# EAGLE design 150226_AriloRX_REV2_0_0 (EAGLE 6.4)
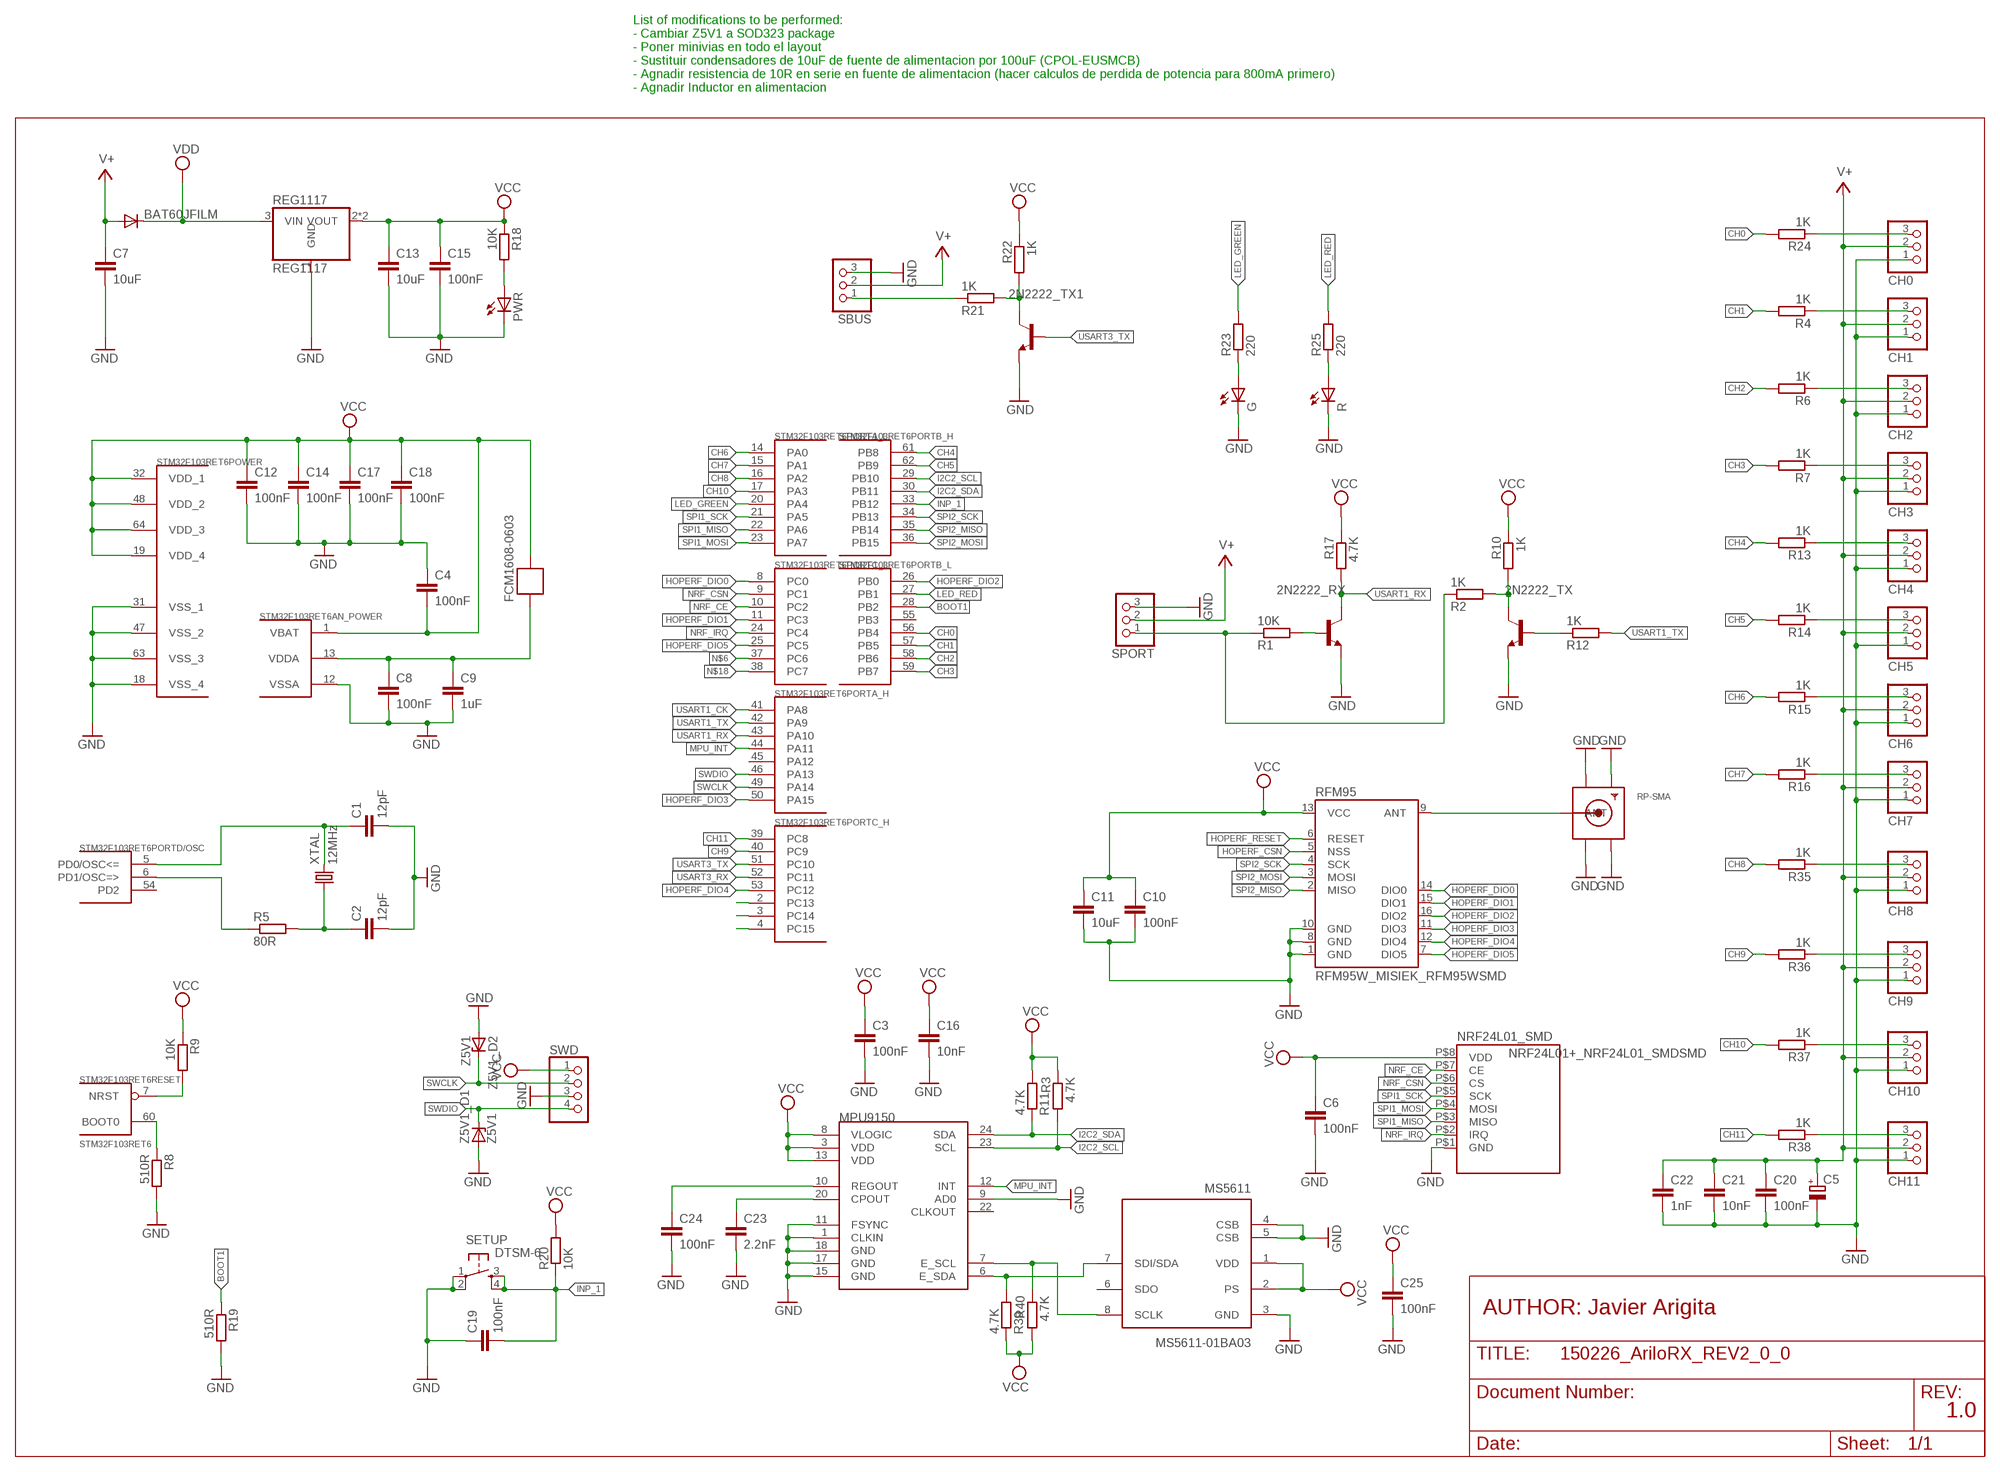
[diagram p0: schematic, sheet 1]

## Parts
2N2222_RX  MMBT2222ALT1-NPN-SOT23-BEC  [SOT23-BEC]
2N2222_TX  MMBT2222ALT1-NPN-SOT23-BEC  [SOT23-BEC]
2N2222_TX1  MMBT2222ALT1-NPN-SOT23-BEC  [SOT23-BEC]
BAT60JFILM  DIODE-SOD323-R  [SOD323-R]
C1  12pF  RESISTOR_C-EUC0603  [RESISTOR_C0603]
C2  12pF  RESISTOR_C-EUC0603  [RESISTOR_C0603]
C3  100nF  RESISTOR_C-EUC0603  [RESISTOR_C0603]
C4  100nF  RESISTOR_C-EUC0603  [RESISTOR_C0603]
C5  CPOL-EUSMCB  [SMC_B]
C6  100nF  RESISTOR_C-EUC0603  [RESISTOR_C0603]
C7  10uF  RESISTOR_C-EUC3216  [RESISTOR_C3216]
C8  100nF  RESISTOR_C-EUC0603  [RESISTOR_C0603]
C9  1uF  RESISTOR_C-EUC0603  [RESISTOR_C0603]
C10  100nF  RESISTOR_C-EUC0603  [RESISTOR_C0603]
C11  10uF  RESISTOR_C-EUC3216  [RESISTOR_C3216]
C12  100nF  RESISTOR_C-EUC0603  [RESISTOR_C0603]
C13  10uF  RESISTOR_C-EUC3216  [RESISTOR_C3216]
C14  100nF  RESISTOR_C-EUC0603  [RESISTOR_C0603]
C15  100nF  RESISTOR_C-EUC0603  [RESISTOR_C0603]
C16  10nF  RESISTOR_C-EUC0603  [RESISTOR_C0603]
C17  100nF  RESISTOR_C-EUC0603  [RESISTOR_C0603]
C18  100nF  RESISTOR_C-EUC0603  [RESISTOR_C0603]
C19  100nF  RESISTOR_C-EUC0603  [RESISTOR_C0603]
C20  100nF  RESISTOR_C-EUC0603  [RESISTOR_C0603]
C21  10nF  RESISTOR_C-EUC0603  [RESISTOR_C0603]
C22  1nF  RESISTOR_C-EUC0603  [RESISTOR_C0603]
C23  2.2nF  RESISTOR_C-EUC0603  [RESISTOR_C0603]
C24  100nF  RESISTOR_C-EUC0603  [RESISTOR_C0603]
C25  100nF  RESISTOR_C-EUC0603  [RESISTOR_C0603]
CH0  PINHD-1X3  [1X03]
CH1  PINHD-1X3  [1X03]
CH2  PINHD-1X3  [1X03]
CH3  PINHD-1X3  [1X03]
CH4  PINHD-1X3  [1X03]
CH5  PINHD-1X3  [1X03]
CH6  PINHD-1X3  [1X03]
CH7  PINHD-1X3  [1X03]
CH8  PINHD-1X3  [1X03]
CH9  PINHD-1X3  [1X03]
CH10  PINHD-1X3  [1X03]
CH11  PINHD-1X3  [1X03]
FCM1608-0603  FERRITE-BEAD  [R0603]
G  LEDCHIP-LED0603  [CHIP-LED0603]
MPU9150  MPU-9150QFN-24-NP  [QFN-24-NP]
MS5611  MS5611-01BA03  [SON125P300X500X100-8N]
NRF24L01_SMD  NRF24L01+_NRF24L01_SMDSMD  [NRF24L01+_NRF24L01_SMD]
PWR  LED_LEDCHIP-LED0603  [LED_CHIP-LED0603]
R  LEDCHIP-LED0603  [CHIP-LED0603]
R1  10K  RCL_R-EU_R0603  [RCL_R0603]
R2  1K  RCL_R-EU_R0603  [RCL_R0603]
R3  4.7K  RCL_R-EU_R0603  [RCL_R0603]
R4  1K  RCL_R-EU_R0603  [RCL_R0603]
R5  80R  RCL_R-EU_R0603  [RCL_R0603]
R6  1K  RCL_R-EU_R0603  [RCL_R0603]
R7  1K  RCL_R-EU_R0603  [RCL_R0603]
R8  510R  RCL_R-EU_R0603  [RCL_R0603]
R9  10K  RCL_R-EU_R0603  [RCL_R0603]
R10  1K  RCL_R-EU_R0603  [RCL_R0603]
R11  4.7K  RCL_R-EU_R0603  [RCL_R0603]
R12  1K  RCL_R-EU_R0603  [RCL_R0603]
R13  1K  RCL_R-EU_R0603  [RCL_R0603]
R14  1K  RCL_R-EU_R0603  [RCL_R0603]
R15  1K  RCL_R-EU_R0603  [RCL_R0603]
R16  1K  RCL_R-EU_R0603  [RCL_R0603]
R17  4.7K  RCL_R-EU_R0603  [RCL_R0603]
R18  10K  RCL_R-EU_R0603  [RCL_R0603]
R19  510R  RCL_R-EU_R0603  [RCL_R0603]
R20  10K  RCL_R-EU_R0603  [RCL_R0603]
R21  1K  RCL_R-EU_R0603  [RCL_R0603]
R22  1K  RCL_R-EU_R0603  [RCL_R0603]
R23  220  RCL_R-EU_R0603  [RCL_R0603]
R24  1K  RCL_R-EU_R0603  [RCL_R0603]
R25  220  RCL_R-EU_R0603  [RCL_R0603]
R35  1K  RCL_R-EU_R0603  [RCL_R0603]
R36  1K  RCL_R-EU_R0603  [RCL_R0603]
R37  1K  RCL_R-EU_R0603  [RCL_R0603]
R38  1K  RCL_R-EU_R0603  [RCL_R0603]
R39  4.7K  RCL_R-EU_R0603  [RCL_R0603]
R40  4.7K  RCL_R-EU_R0603  [RCL_R0603]
REG1117  REG1117  [SOT223]
RFM95  RFM95W_MISIEK_RFM95WSMD  [RFM95W_MISIEK_RFM95W_SMD]
RP-SMA  SMACONNECTOR_EDGE  [SMA_EDGELAUNCH]
SBUS  PINHD-1X3  [1X03]
SETUP  DTSM-6  [DTSM-6]
SPORT  PINHD-1X3  [1X03]
STM32F103RET6  STM32F103RET6  STM32F10XRXT6  [TQFP64]
SWD  PINHD-1X4  [1X04]
XTAL  12MHz  CRYSTAL5X3  [CRYSTAL-SMD-5X3]
Z5V1_D1  Z5V1  ZENER-DIODESOD80C  [SOD80C]
Z5V1_D2  Z5V1  ZENER-DIODESOD80C  [SOD80C]

## Nets
BOOT1: R19.1 STM32F103RET6.28(PORTB_L:PB2)
CH0: R24.2 STM32F103RET6.56(PORTB_L:PB4)
CH1: R4.2 STM32F103RET6.57(PORTB_L:PB5)
CH2: R6.2 STM32F103RET6.58(PORTB_L:PB6)
CH3: R7.2 STM32F103RET6.59(PORTB_L:PB7)
CH4: R13.2 STM32F103RET6.61(PORTB_H:PB8)
CH5: R14.2 STM32F103RET6.62(PORTB_H:PB9)
CH6: R15.2 STM32F103RET6.14(PORTA_L:PA0)
CH7: R16.2 STM32F103RET6.15(PORTA_L:PA1)
CH8: R35.2 STM32F103RET6.16(PORTA_L:PA2)
CH9: R36.2 STM32F103RET6.40(PORTC_H:PC9)
CH10: R37.2 STM32F103RET6.17(PORTA_L:PA3)
CH11: R38.2 STM32F103RET6.39(PORTC_H:PC8)
GND: 2N2222_RX.E 2N2222_TX1.E 2N2222_TX.E C1.2 C2.2 C3.2 C4.1 C5.- C6.2 C7.2 C8.2 C9.2 C10.2 C11.2 C12.2 C13.2 C14.2 C15.2 C16.2 C17.2 C18.2 C19.1 C20.2 C21.2 C22.2 C23.2 C24.2 C25.2 CH0.1 CH1.1 CH2.1 CH3.1 CH4.1 CH5.1 CH6.1 CH7.1 CH8.1 CH9.1 CH10.1 CH11.1 G.C MPU9150.1(CLKIN) MPU9150.9(AD0) MPU9150.11(FSYNC) MPU9150.15(GND) MPU9150.17(GND) MPU9150.18(GND) MS5611.3(GND) MS5611.4(CSB) MS5611.5(CSB) NRF24L01_SMD.P$1(GND) PWR.C R8.2 R19.2 R.C REG1117.1(GND) RFM95.1(GND) RFM95.8(GND) RFM95.10(GND) RP-SMA.GND@1(GND4) RP-SMA.GND@2(GND3) RP-SMA.GND@3(GND2) RP-SMA.GND@4(GND1) SBUS.3 SETUP.1 SETUP.2 SPORT.3 STM32F103RET6.12(AN_POWER:VSSA) STM32F103RET6.18(POWER:VSS_4) STM32F103RET6.31(POWER:VSS_1) STM32F103RET6.47(POWER:VSS_2) STM32F103RET6.63(POWER:VSS_3) SWD.3 Z5V1_D1.A Z5V1_D2.A
HOPERF_CSN: RFM95.5(NSS)
HOPERF_DIO0: RFM95.14(DIO0) STM32F103RET6.8(PORTC_L:PC0)
HOPERF_DIO1: RFM95.15(DIO1) STM32F103RET6.11(PORTC_L:PC3)
HOPERF_DIO2: RFM95.16(DIO2) STM32F103RET6.26(PORTB_L:PB0)
HOPERF_DIO3: RFM95.11(DIO3) STM32F103RET6.50(PORTA_H:PA15)
HOPERF_DIO4: RFM95.12(DIO4) STM32F103RET6.53(PORTC_H:PC12)
HOPERF_DIO5: RFM95.7(DIO5) STM32F103RET6.25(PORTC_L:PC5)
HOPERF_RESET: RFM95.6(RESET)
I2C2_SCL: MPU9150.23(SCL) R3.2 STM32F103RET6.29(PORTB_H:PB10)
I2C2_SDA: MPU9150.24(SDA) R11.1 STM32F103RET6.30(PORTB_H:PB11)
INP_1: C19.2 R20.1 SETUP.3 SETUP.4 STM32F103RET6.33(PORTB_H:PB12)
LED_GREEN: R23.2 STM32F103RET6.20(PORTA_L:PA4)
LED_RED: R25.2 STM32F103RET6.27(PORTB_L:PB1)
MPU_INT: MPU9150.12(INT) STM32F103RET6.44(PORTA_H:PA11)
N$1: C1.1 STM32F103RET6.5(PORTD/OSC:PD0/OSC<=) XTAL.3
N$2: R5.1 STM32F103RET6.6(PORTD/OSC:PD1/OSC=>)
N$3: C2.1 R5.2 XTAL.1
N$4: R8.1 STM32F103RET6.60(RESET:BOOT0)
N$5: 2N2222_TX.C R2.2 R10.2
N$6: STM32F103RET6.37(PORTC_L:PC6)
N$7: RFM95.9(ANT) RP-SMA.P(ANT)
N$8: 2N2222_TX.B R12.1
N$9: CH0.3 R24.1
N$10: PWR.A R18.2
N$11: 2N2222_TX1.C R21.2 R22.2
N$12: G.A R23.1
N$13: CH8.3 R35.1
N$14: R1.1 R2.1 SPORT.1
N$15: R25.1 R.A
N$16: 2N2222_RX.B R1.2
N$17: C8.1 C9.1 FCM1608-0603.2 STM32F103RET6.13(AN_POWER:VDDA)
N$18: STM32F103RET6.38(PORTC_L:PC7)
N$20: STM32F103RET6.2(PORTC_H:PC13)
N$21: CH2.3 R6.1
N$22: STM32F103RET6.3(PORTC_H:PC14)
N$23: CH4.3 R13.1
N$24: STM32F103RET6.4(PORTC_H:PC15)
N$25: CH9.3 R36.1
N$26: CH10.3 R37.1
N$27: CH11.3 R38.1
N$28: MPU9150.7(E_SCL) MS5611.8(SCLK) R40.1
N$29: MPU9150.6(E_SDA) MS5611.7(SDI/SDA) R39.2
N$31: CH3.3 R7.1
N$32: CH6.3 R15.1
N$33: C23.1 MPU9150.20(CPOUT)
N$34: CH5.3 R14.1
N$35: CH7.3 R16.1
N$40: C24.1 MPU9150.10(REGOUT)
N$53: CH1.3 R4.1
NRF_CE: NRF24L01_SMD.P$7(CE) STM32F103RET6.10(PORTC_L:PC2)
NRF_CSN: NRF24L01_SMD.P$6(CS) STM32F103RET6.9(PORTC_L:PC1)
NRF_IRQ: NRF24L01_SMD.P$2(IRQ) STM32F103RET6.24(PORTC_L:PC4)
NSRST: R9.2 STM32F103RET6.7(RESET:NRST)
SBUS: R21.1 SBUS.1
SPI1_MISO: NRF24L01_SMD.P$3(MISO) STM32F103RET6.22(PORTA_L:PA6)
SPI1_MOSI: NRF24L01_SMD.P$4(MOSI) STM32F103RET6.23(PORTA_L:PA7)
SPI1_SCK: NRF24L01_SMD.P$5(SCK) STM32F103RET6.21(PORTA_L:PA5)
SPI2_MISO: RFM95.2(MISO) STM32F103RET6.35(PORTB_H:PB14)
SPI2_MOSI: RFM95.3(MOSI) STM32F103RET6.36(PORTB_H:PB15)
SPI2_SCK: RFM95.4(SCK) STM32F103RET6.34(PORTB_H:PB13)
SWCLK: STM32F103RET6.49(PORTA_H:PA14) SWD.2 Z5V1_D2.C
SWDIO: STM32F103RET6.46(PORTA_H:PA13) SWD.4 Z5V1_D1.C
USART1_CK: STM32F103RET6.41(PORTA_H:PA8)
USART1_RX: 2N2222_RX.C R17.2 STM32F103RET6.43(PORTA_H:PA10)
USART1_TX: R12.2 STM32F103RET6.42(PORTA_H:PA9)
USART3_RX: STM32F103RET6.52(PORTC_H:PC11)
USART3_TX: 2N2222_TX1.B STM32F103RET6.51(PORTC_H:PC10)
V+: BAT60JFILM.A C5.+ C7.1 C20.1 C21.1 C22.1 CH0.2 CH1.2 CH2.2 CH3.2 CH4.2 CH5.2 CH6.2 CH7.2 CH8.2 CH9.2 CH10.2 CH11.2 SBUS.2 SPORT.2
VCC: C3.1 C4.2 C6.1 C10.1 C11.1 C12.1 C13.1 C14.1 C15.1 C16.1 C17.1 C18.1 C25.1 FCM1608-0603.1 MPU9150.3(VDD) MPU9150.8(VLOGIC) MPU9150.13(VDD) MS5611.1(VDD) MS5611.2(PS) NRF24L01_SMD.P$8(VDD) R3.1 R9.1 R10.1 R11.2 R17.1 R18.1 R20.2 R22.1 R39.1 R40.2 REG1117.2(VOUT) REG1117.4(VOUT) RFM95.13(VCC) STM32F103RET6.1(AN_POWER:VBAT) STM32F103RET6.19(POWER:VDD_4) STM32F103RET6.32(POWER:VDD_1) STM32F103RET6.48(POWER:VDD_2) STM32F103RET6.64(POWER:VDD_3) SWD.1
VDD: BAT60JFILM.C REG1117.3(VIN)
Unconnected: MPU9150.22(CLKOUT) MS5611.6(SDO) STM32F103RET6.45(PORTA_H:PA12) STM32F103RET6.54(PORTD/OSC:PD2) STM32F103RET6.55(PORTB_L:PB3)

## Notes on the sheet
- List of modifications to be performed:
  - Cambiar Z5V1 a SOD323 package
  - Poner minivias en todo el layout
  - Sustituir condensadores de 10uF de fuente de alimentacion por 100uF (CPOL-EUSMCB)
  - Agnadir resistencia de 10R en serie en fuente de alimentacion (hacer calculos de perdida de potencia para 800mA primero)
  - Agnadir Inductor en alimentacion
- AUTHOR: Javier Arigita
- 1.0

## Library data of the parts
2N2222_RX 2N2222_TX 2N2222_TX1 = transistor:*-NPN-: NPN Transistror BF959 corrected 2008.03.06
BAT60JFILM = diode:DIODE-: DIODE
C1-C4 C6-C25 = AriloTX:RESISTOR_C-EU: CAPACITOR, European symbol
C5 = rcl:CPOL-EU: POLARIZED CAPACITOR, European symbol
CH0 CH1-CH11 SBUS SPORT = pinhead_rc:PINHD-1X3: PIN HEADER
FCM1608-0603 = BaseApp:FERRITE-BEAD
G R = led:LED: LED OSRAM: - CHIPLED LG R971, LG N971, LY N971, LG Q971, LY Q971, LO R971, LY R971 LH N974, LH R974 LS Q976, LO Q976, LY Q976 LO Q996 - Hyper CHIPLED LW Q18S LB Q993, LB Q99A, LB R99A - SideLED LS A670, LO A670, LY A670, LG A670, LP A670 LB A673, LV A673, LT A673, LW A673 LH A674 LY A675 LS A676, LA A676, LO A676, LY A676, LW A676 LS A679, LY A679, LG A679 - Hyper Micro SIDELED® LS Y876, LA Y876, LO Y876, LY Y876 LT Y87S - SmartLED LW L88C, LW L88S LB L89C, LB L89S, LG L890 LS L89K, LO L89K, LY L89K LS L896, LA L896, LO L896, LY L896 - TOPLED LS T670, LO T670, LY T670, LG T670, LP T670 LSG T670, LSP T670, LSY T670, LOP T670, LYG T670 LG T671, LOG T671, LSG T671 LB T673, LV T673, LT T673, LW T673 LH T674 LS T676, LA T676, LO T676, LY T676, LB T676, LH T676, LSB T676, LW T676 LB T67C, LV T67C, LT T67C, LS T67K, LO T67K, LY T67K, LW E67C LS E67B, LA E67B, LO E67B, LY E67B, LB E67C, LV E67C, LT E67C LW T67C LS T679, LY T679, LG T679 LS T770, LO T770, LY T770, LG T770, LP T770 LB T773, LV T773, LT T773, LW T773 LH T774 LS E675, LA E675, LY E675, LS T675 LS T776, LA T776, LO T776, LY T776, LB T776 LHGB T686 LT T68C, LB T68C - Hyper Mini TOPLED® LB M676 - Mini TOPLED Santana® LG M470 LS M47K, LO M47K, LY M47K Source: http://www.osram.convergy.de LUXEON: - LUMILED® LXK2-PW12-R00, LXK2-PW12-S00, LXK2-PW14-U00, LXK2-PW14-V00 LXK2-PM12-R00, LXK2-PM12-S00, LXK2-PM14-U00 LXK2-PE12-Q00, LXK2-PE12-R00, LXK2-PE12-S00, LXK2-PE14-T00, LXK2-PE14-U00 LXK2-PB12-K00, LXK2-PB12-L00, LXK2-PB12-M00, LXK2-PB14-N00, LXK2-PB14-P00, LXK2-PB14-Q00 LXK2-PR12-L00, LXK2-PR12-M00, LXK2-PR14-Q00, LXK2-PR14-R00 LXK2-PD12-Q00, LXK2-PD12-R00, LXK2-PD12-S00 LXK2-PH12-R00, LXK2-PH12-S00 LXK2-PL12-P00, LXK2-PL12-Q00, LXK2-PL12-R00 Source: www.luxeon.com KINGBRIGHT: KA-3528ASYC Source: www.kingbright.com
MPU9150 = SparkFun-Sensors:MPU-9150: 9DOF (3mag, 3accel, 3rotat). I2C interface.
MS5611 = Measurement-Specialties:MS5611-01BA03: Variometer Module, with stainless steel cap
NRF24L01_SMD = Arilo_TX140810_AriloTX_REV3_0_0_868MHZ_td:NRF24L01+_NRF24L01_SMD
PWR = AriloTX:LED_LED: LED OSRAM: - CHIPLED LG R971, LG N971, LY N971, LG Q971, LY Q971, LO R971, LY R971 LH N974, LH R974 LS Q976, LO Q976, LY Q976 LO Q996 - Hyper CHIPLED LW Q18S LB Q993, LB Q99A, LB R99A - SideLED LS A670, LO A670, LY A670, LG A670, LP A670 LB A673, LV A673, LT A673, LW A673 LH A674 LY A675 LS A676, LA A676, LO A676, LY A676, LW A676 LS A679, LY A679, LG A679 - Hyper Micro SIDELED® LS Y876, LA Y876, LO Y876, LY Y876 LT Y87S - SmartLED LW L88C, LW L88S LB L89C, LB L89S, LG L890 LS L89K, LO L89K, LY L89K LS L896, LA L896, LO L896, LY L896 - TOPLED LS T670, LO T670, LY T670, LG T670, LP T670 LSG T670, LSP T670, LSY T670, LOP T670, LYG T670 LG T671, LOG T671, LSG T671 LB T673, LV T673, LT T673, LW T673 LH T674 LS T676, LA T676, LO T676, LY T676, LB T676, LH T676, LSB T676, LW T676 LB T67C, LV T67C, LT T67C, LS T67K, LO T67K, LY T67K, LW E67C LS E67B, LA E67B, LO E67B, LY E67B, LB E67C, LV E67C, LT E67C LW T67C LS T679, LY T679, LG T679 LS T770, LO T770, LY T770, LG T770, LP T770 LB T773, LV T773, LT T773, LW T773 LH T774 LS E675, LA E675, LY E675, LS T675 LS T776, LA T776, LO T776, LY T776, LB T776 LHGB T686 LT T68C, LB T68C - Hyper Mini TOPLED® LB M676 - Mini TOPLED Santana® LG M470 LS M47K, LO M47K, LY M47K Source: http://www.osram.convergy.de LUXEON: - LUMILED® LXK2-PW12-R00, LXK2-PW12-S00, LXK2-PW14-U00, LXK2-PW14-V00 LXK2-PM12-R00, LXK2-PM12-S00, LXK2-PM14-U00 LXK2-PE12-Q00, LXK2-PE12-R00, LXK2-PE12-S00, LXK2-PE14-T00, LXK2-PE14-U00 LXK2-PB12-K00, LXK2-PB12-L00, LXK2-PB12-M00, LXK2-PB14-N00, LXK2-PB14-P00, LXK2-PB14-Q00 LXK2-PR12-L00, LXK2-PR12-M00, LXK2-PR14-Q00, LXK2-PR14-R00 LXK2-PD12-Q00, LXK2-PD12-R00, LXK2-PD12-S00 LXK2-PH12-R00, LXK2-PH12-S00 LXK2-PL12-P00, LXK2-PL12-Q00, LXK2-PL12-R00 Source: www.luxeon.com KINGBRIGHT: KA-3528ASYC Source: www.kingbright.com
R1-R25 R35-R40 = AriloTX:RCL_R-EU_: RESISTOR, European symbol
REG1117 = CEDT:REG1117: 800mA and 1A Low Dropout (LDO) Positive Regulator 1.8V, 2.5V, 2.85V, 3.3V, 5V, and Adj
RFM95 = AriloTX:RFM95W_MISIEK_RFM95W
RP-SMA = adafruit:SMACONNECTOR: SMA Connector 90° DIP SMA Connector, 50 Ohm (4UConnector: 07259)
SETUP = switch-tact:DTSM-6
STM32F103RET6 = stm32:STM32F10XRXT6: STM32F101/103 64pin LQFP
SWD = pinhead:PINHD-1X4: PIN HEADER
XTAL = SparkFun-FreqCtrl:CRYSTAL: Various standard crystals. Proven footprints. Spark Fun Electronics SKU : COM-00534
Z5V1_D1 Z5V1_D2 = diode:ZENER-DIODE: Z-Diode

## Board
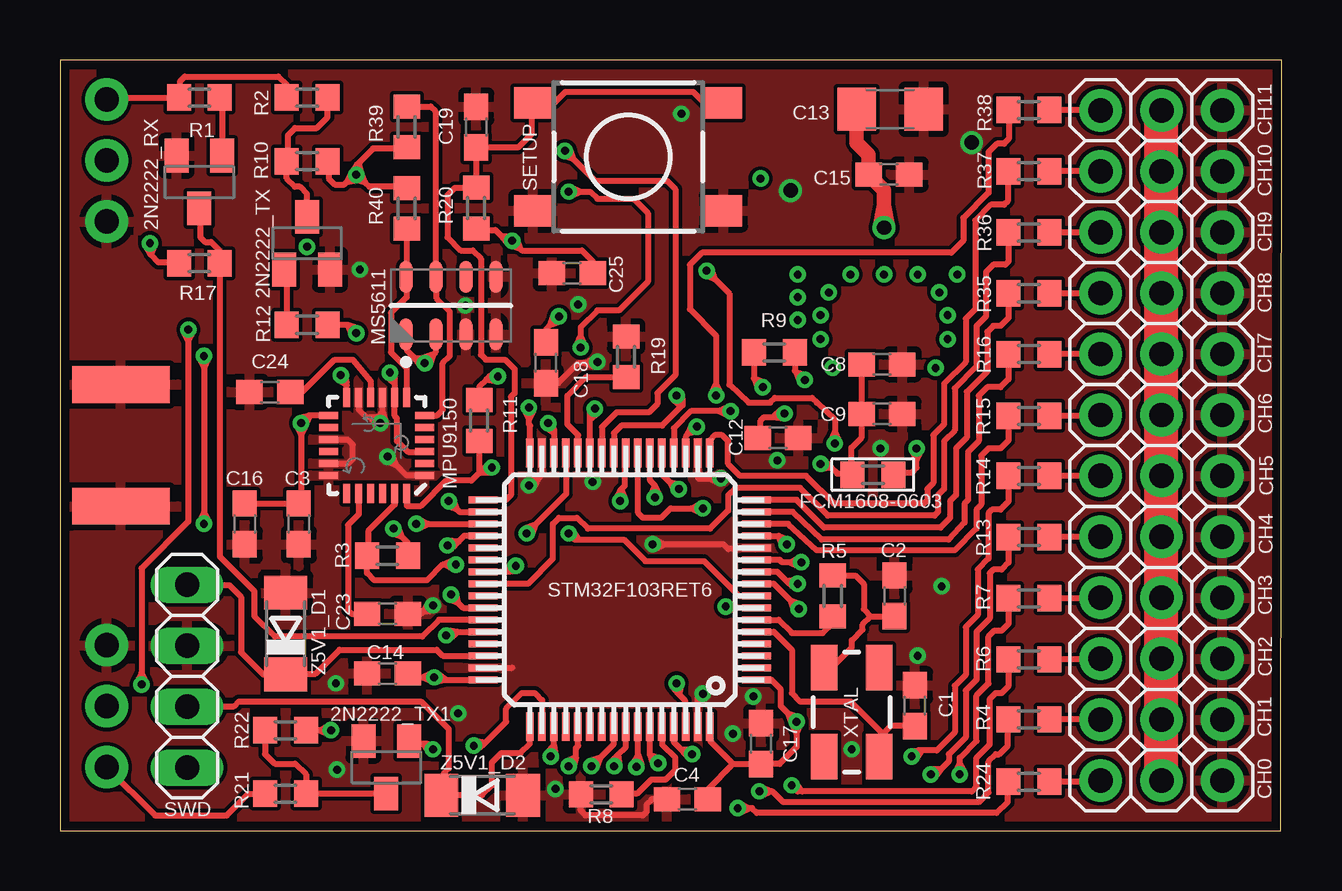
[diagram p1: board, top side]
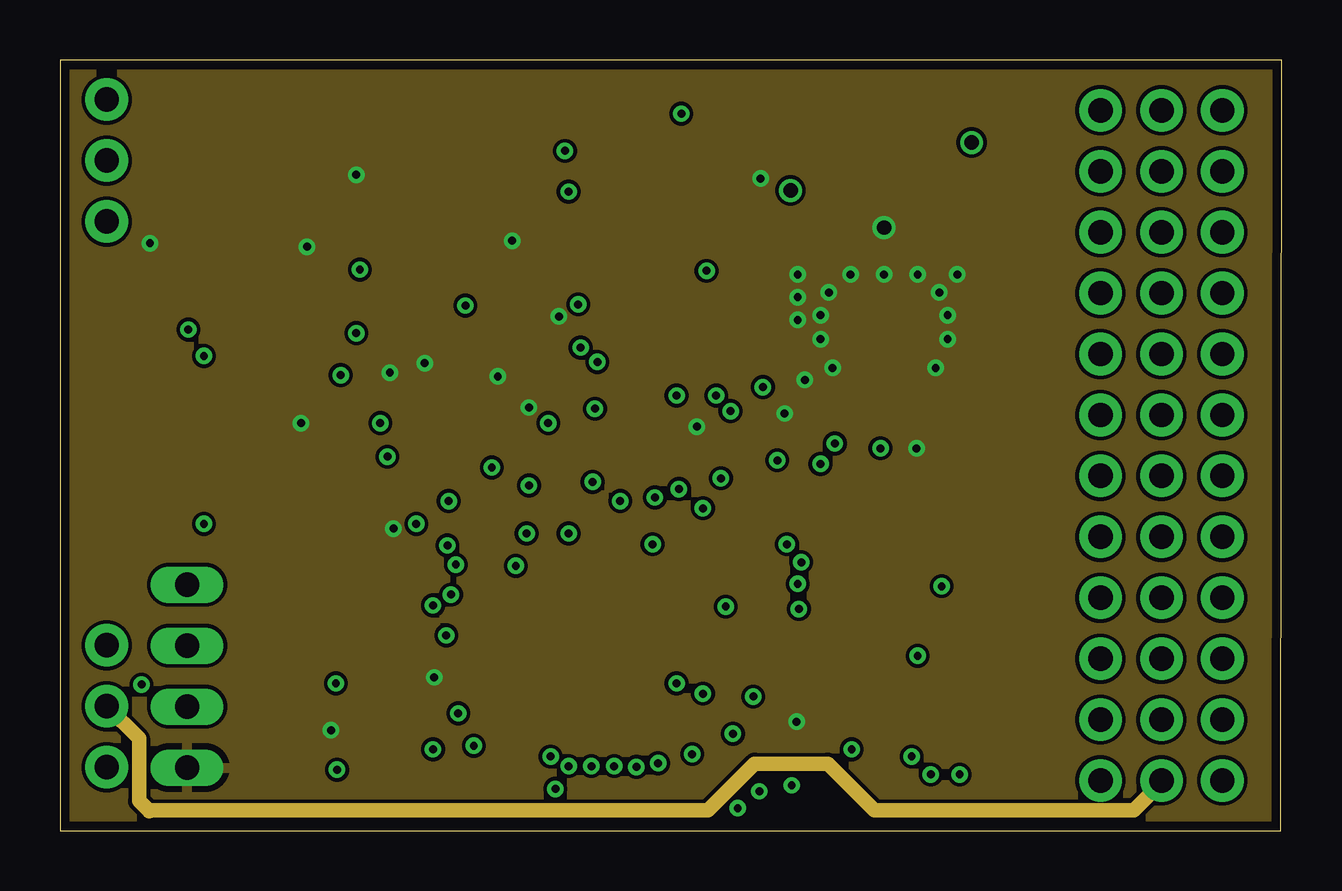
[diagram p2: board, inner layer Route2]
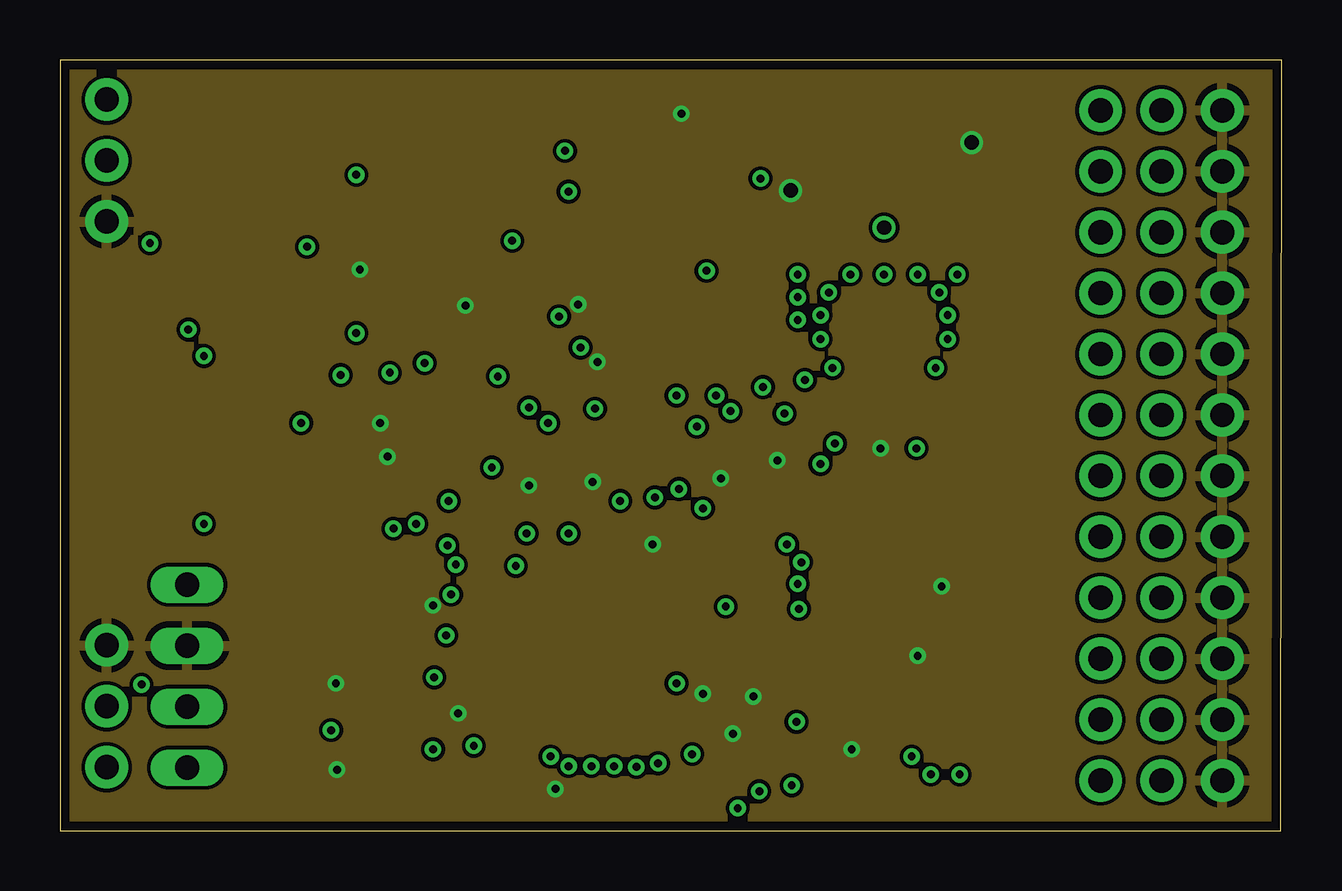
[diagram p3: board, inner layer Route15]
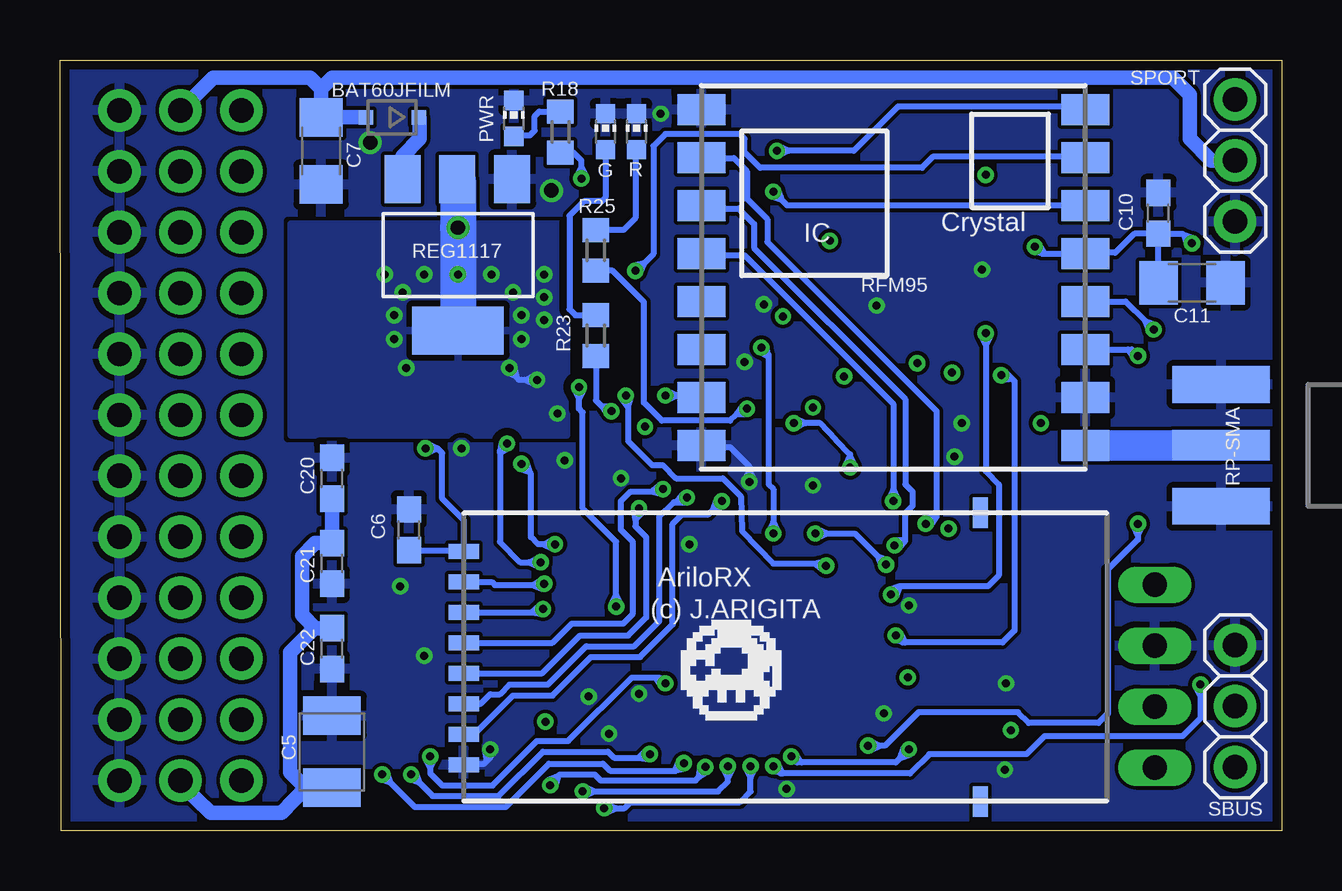
[diagram p4: board, bottom side, seen from below]

Size 50.94 x 32.14 mm. Coordinates in mm from the lower left corner, seen from the top.
Outline: 0,0 50.88,0 50.94,32.14 0,32.14 0,0
Copper layers (1*2*15*16): Top 0.0356mm / dielectric 0.17018125mm / Route2 0.0178mm / dielectric 47mil / Route15 0.0178mm / dielectric 0.17018125mm / Bottom 0.0356mm
Design rules "LaenPCBOrder *": minimum track width 6mil, minimum drill 13mil, track to track 6mil, track to pad 6mil, pad to pad 6mil, via to via 6mil, smd to smd 6mil, copper to edge 15mil, drill to drill 6mil, minimum pad ring 7mil, minimum via ring 7mil, stop-mask expansion 4mil, vias tented up to drill 0mil, thermal gap 10mil

### Footprints (pad centres in the part's own frame; a part is rotated, then mirrored left to right if it is on the bottom)
SOT23-BEC = smd 1 x 1.4: B -0.95,-1.1; C 0,1.1; E 0.95,-1.1
SOD323-R = smd 0.6 x 0.6: A 1.1,0; C -1.1,0
RESISTOR_C0603 = smd 1.1 x 1: 1 -0.85,0; 2 0.85,0
SMC_B = smd 1.6 x 2.4: + -1.5,0; - 1.5,0
RESISTOR_C3216 = smd 1.6 x 1.8: 1 -1.4,0; 2 1.4,0
1X03 = drill 1.016 pad 1.778: 1 -2.54,0; 2 0,0; 3 2.54,0
R0603 = smd 1 x 1.1: 1 -0.85,0; 2 0.85,0
CHIP-LED0603 = smd 0.8 x 0.8: A 0,-0.75; C 0,0.75
QFN-24-NP = smd 0.8 x 0.3: 1 -2,1.25; 2 -2,0.75; 3 -2,0.25; 4 -2,-0.25; 5 -2,-0.75; 6 -2,-1.25; 13 2,-1.25; 14 2,-0.75; 15 2,-0.25; 16 2,0.25; 17 2,0.75; 18 2,1.25 | smd 0.3 x 0.8: 7 -1.25,-2; 8 -0.75,-2; 9 -0.25,-2; 10 0.25,-2; 11 0.75,-2; 12 1.25,-2; 19 1.25,2; 20 0.75,2; 21 0.25,2; 22 -0.25,2; 23 -0.75,2; 24 -1.25,2
SON125P300X500X100-8N = smd 1.35 x 0.55: 1 -1.2,1.875; 2 -1.2,0.625; 3 -1.2,-0.625; 4 -1.2,-1.875; 5 1.2,-1.875; 6 1.2,-0.625; 7 1.2,0.625; 8 1.2,1.875
NRF24L01+_NRF24L01_SMD = smd 1.27 x 0.635: P$1 26.807,10.492; P$2 26.807,9.222; P$3 26.807,7.952; P$4 26.807,6.682; P$5 26.807,5.412; P$6 26.807,4.142; P$7 26.807,2.872; P$8 26.807,1.602 | smd 0.635 x 1.27: P$11 5.267,-0.018; P$13 5.267,12.032
LED_CHIP-LED0603 = smd 0.8 x 0.8: A 0,-0.75; C 0,0.75
RCL_R0603 = smd 1 x 1.1: 1 -0.85,0; 2 0.85,0
SOT223 = smd 1.499 x 2.007: 1 -2.261,-3.15; 2 0.025,-3.15; 3 2.311,-3.15 | smd 3.81 x 2.007: 4 0,3.15
RFM95W_MISIEK_RFM95W_SMD = smd 2 x 1.3: 1 -8,7; 2 -8,5; 3 -8,3; 4 -8,1; 5 -8,-1; 6 -8,-3; 7 -8,-5; 8 -8,-7; 9 8,-7; 10 8,-5; 11 8,-3; 12 8,-1; 13 8,1; 14 8,3; 15 8,5; 16 8,7
SMA_EDGELAUNCH = smd 4.064 x 1.524: GND@1 2.032,-2.54; GND@2 2.032,2.54 | smd 4.064 x 1.524 bottom: GND@3 2.032,2.54; GND@4 2.032,-2.54 | smd 4.064 x 1.27: P 2.032,0
DTSM-6 = smd 1.55 x 1.3: 1 -3.975,2.25; 2 3.975,2.25; 3 -3.975,-2.25; 4 3.975,-2.25
TQFP64 = smd 1.2 x 0.3: 1 -5.7,3.75; 2 -5.7,3.25; 3 -5.7,2.75; 4 -5.7,2.25; 5 -5.7,1.75; 6 -5.7,1.25; 7 -5.7,0.75; 8 -5.7,0.25; 9 -5.7,-0.25; 10 -5.7,-0.75; 11 -5.7,-1.25; 12 -5.7,-1.75; 13 -5.7,-2.25; 14 -5.7,-2.75; 15 -5.7,-3.25; 16 -5.7,-3.75; 33 5.7,-3.75; 34 5.7,-3.25; 35 5.7,-2.75; 36 5.7,-2.25; 37 5.7,-1.75; 38 5.7,-1.25; 39 5.7,-0.75; 40 5.7,-0.25; 41 5.7,0.25; 42 5.7,0.75; 43 5.7,1.25; 44 5.7,1.75; 45 5.7,2.25; 46 5.7,2.75; 47 5.7,3.25; 48 5.7,3.75 | smd 0.3 x 1.2: 17 -3.75,-5.7; 18 -3.25,-5.7; 19 -2.75,-5.7; 20 -2.25,-5.7; 21 -1.75,-5.7; 22 -1.25,-5.7; 23 -0.75,-5.7; 24 -0.25,-5.7; 25 0.25,-5.7; 26 0.75,-5.7; 27 1.25,-5.7; 28 1.75,-5.7; 29 2.25,-5.7; 30 2.75,-5.7; 31 3.25,-5.7; 32 3.75,-5.7; 49 3.75,5.7; 50 3.25,5.7; 51 2.75,5.7; 52 2.25,5.7; 53 1.75,5.7; 54 1.25,5.7; 55 0.75,5.7; 56 0.25,5.7; 57 -0.25,5.7; 58 -0.75,5.7; 59 -1.25,5.7; 60 -1.75,5.7; 61 -2.25,5.7; 62 -2.75,5.7; 63 -3.25,5.7; 64 -3.75,5.7
1X04 = drill 1.016 long: 1 -3.81,0; 2 -1.27,0; 3 1.27,0; 4 3.81,0
CRYSTAL-SMD-5X3 = smd 1.9 x 1.1: 1 -1.85,-1.15; 2 1.85,-1.15; 3 1.85,1.15; 4 -1.85,1.15
SOD80C = smd 1.4 x 1.8: A 1.7,0; C -1.7,0

### Placement (x,y rotation side)
2N2222_RX  5.81,27.05 180 top
2N2222_TX  10.3,24.5 0 top
2N2222_TX1  13.6,2.65 180 top
BAT60JFILM  37.09,29.75 180 bottom
C1  35.64,5.22 90 top
C2  34.79,9.8 90 top
C3  9.95,12.8 270 top
C4  26.15,1.32 0 top
C5  39.6,3.3 90 bottom
C6  36.38,12.55 90 bottom
C7  40.05,28.35 270 bottom
C8  34.26,19.45 0 top
C9  34.26,17.39 0 top
C10  5.15,25.75 90 bottom
C11  3.75,22.85 0 bottom
C12  29.93,16.39 0 top
C13  34.6,30.09 0 top
C14  13.65,6.56 180 top
C15  34.55,27.36 0 top
C16  7.7,12.8 270 top
C17  29.23,3.64 90 top
C18  20.25,19.52 270 top
C19  17.35,29.34 270 top
C20  39.6,14.7 90 bottom
C21  39.6,11.15 270 bottom
C22  39.6,7.6 270 bottom
C23  13.65,9.05 0 top
C24  8.75,18.3 180 top
C25  21.35,23.25 180 top
CH0  45.91,2.1 180 top
CH1  45.91,4.64 180 top
CH2  45.91,7.18 180 top
CH3  45.91,9.72 180 top
CH4  45.91,12.26 180 top
CH5  45.91,14.8 180 top
CH6  45.91,17.34 180 top
CH7  45.91,19.88 180 top
CH8  45.91,22.42 180 top
CH9  45.91,24.96 180 top
CH10  45.91,27.5 180 top
CH11  45.91,30.04 180 top
FCM1608-0603  33.88,14.85 180 top
G  28.2,29.15 0 bottom
MPU9150  13.2,16.07 180 top
MS5611  16.3,21.9 90 top
NRF24L01_SMD  7.3,13.25 180 bottom
PWR  32.02,29.7 0 bottom
R  26.9,29.15 0 bottom
R1  5.81,30.57 0 top
R2  10.3,30.57 0 top
R3  13.65,11.47 180 top
R4  40.38,4.65 180 top
R5  32.21,9.8 90 top
R6  40.38,7.15 180 top
R7  40.38,9.7 180 top
R8  22.56,1.52 180 top
R9  29.77,19.95 180 top
R10  10.3,27.91 180 top
R11  17.48,17.11 90 top
R12  10.3,21.1 0 top
R13  40.38,12.25 180 top
R14  40.38,14.8 180 top
R15  40.38,17.3 180 top
R16  40.38,19.88 180 top
R17  5.81,23.66 0 top
R18  30.07,29.14 90 bottom
R19  23.6,19.77 90 top
R20  17.35,25.96 270 top
R21  9.4,1.55 0 top
R22  9.4,4.2 180 top
R23  28.6,20.65 270 bottom
R24  40.38,2.05 180 top
R25  28.6,24.2 270 bottom
R35  40.38,22.41 180 top
R36  40.38,24.95 180 top
R37  40.38,27.5 180 top
R38  40.38,30.05 180 top
R39  14.45,29.35 90 top
R40  14.45,25.95 90 top
REG1117  34.35,24.02 180 bottom
RFM95  16.2,23.07 0 bottom
RP-SMA  0.5,16.07 180 bottom
SBUS  1.95,5.2 90 bottom
SETUP  23.68,28.1 180 top
SPORT  1.95,27.95 270 bottom
STM32F103RET6  23.34,10.05 180 top
SWD  5.3,6.45 90 top
XTAL  33,4.95 270 top
Z5V1_D1  9.41,8.22 90 top
Z5V1_D2  17.6,1.49 0 top

### Tracks (layer width: path | path; a pad name or v marks a point on that pad's centre or on a via)
BOOT1
  Top 0.254: STM32F103RET6.28 21.6,15.77 21.6,16.5 21.15,16.95 21.15,18.15 21.91,18.91 R19.1
CH0  (via drill 0.33 pad 0.25)
  Top 0.254: 28.75,0.95 28.85,0.95 29.05,0.75 39.05,0.75 39.5,1.2 39.5,2.02 R24.2 | 28.75,0.95 v28.25,0.95 | v22.15,2.7 22.5,3.05 | 22.5,3.05 23.09,3.63 STM32F103RET6.56 | 28.75,0.95 28.34,1.14 v28.25,0.95 | 28.75,0.95 28.34,0.76 v28.25,0.95 | 22.5,3.05 22.08,2.9 v22.15,2.7 | 22.5,3.05 22.35,2.63 v22.15,2.7
  Bottom 0.254: v28.25,0.95 27.75,0.95 | 27.75,0.95 27.4,0.95 27.15,1.2 22.6,1.2 22.15,1.65 22.15,2.21 | 22.15,2.21 v22.15,2.7 | 27.75,0.95 28.16,0.76 v28.25,0.95 | 27.75,0.95 28.16,1.14 v28.25,0.95 | 22.15,2.21 22.34,2.61 v22.15,2.7 | 22.15,2.21 21.96,2.61 v22.15,2.7
CH1  (via drill 0.33 pad 0.25)
  Top 0.254: 29.64,1.65 29.7,1.65 30.15,1.2 38.3,1.2 38.7,1.6 38.7,2.9 39,3.2 39.15,3.2 39.5,3.55 39.5,4.62 R4.2 | 29.64,1.65 v29.15,1.65 | v23.1,2.7 23.1,3 23.27,3.17 | 23.27,3.17 23.59,3.48 STM32F103RET6.57 | 29.64,1.65 29.24,1.84 v29.15,1.65 | 29.64,1.65 29.24,1.46 v29.15,1.65 | 23.27,3.17 22.95,2.85 v23.1,2.7 | 23.27,3.17 23.32,2.72 v23.1,2.7
  Bottom 0.254: v29.15,1.65 28.66,1.65 | 28.66,1.65 23.5,1.65 23.1,2.05 23.1,2.21 | 23.1,2.21 v23.1,2.7 | 28.66,1.65 29.06,1.46 v29.15,1.65 | 28.66,1.65 29.06,1.84 v29.15,1.65 | 23.1,2.21 23.29,2.61 v23.1,2.7 | 23.1,2.21 22.91,2.61 v23.1,2.7
CH2  (via drill 0.33 pad 0.25)
  Top 0.254: 30.93,1.65 38,1.65 38.2,1.85 38.2,3.05 38.75,3.6 38.75,5.5 39,5.75 39.25,5.75 39.55,6.05 39.55,7.13 R6.2 | 30.93,1.65 30.75,1.65 v30.5,1.9 | v24.03,2.67 24.09,2.73 24.09,3.16 | 24.09,3.16 STM32F103RET6.58 | 30.93,1.65 30.68,2.02 v30.5,1.9 | 30.93,1.65 30.48,1.69 v30.5,1.9 | 24.09,3.16 23.85,2.79 v24.03,2.67 | 24.09,3.16 24.23,2.74 v24.03,2.67
  Bottom 0.254: v30.5,1.9 30.17,2.27 | 30.17,2.27 30.1,2.35 28.65,2.35 28.4,2.1 24.44,2.1 24.29,2.25 | 24.29,2.25 24.03,2.51 v24.03,2.67 | 30.17,2.27 30.29,1.84 v30.5,1.9 | 30.17,2.27 30.58,2.1 v30.5,1.9 | 24.29,2.25 24.25,2.69 v24.03,2.67 | 24.29,2.25 23.91,2.49 v24.03,2.67
CH3  (via drill 0.33, 0.33 pad 0.25)
  Top 0.254: v24.93,2.82 24.59,3.17 | 24.59,3.17 | 24.59,3.17 STM32F103RET6.59 | v37.5,2.35 37.5,2.85 | 37.5,2.85 37.5,3.05 38.2,3.75 38.2,5.65 38.7,6.15 38.7,8.1 38.95,8.35 39.25,8.35 39.55,8.65 39.55,9.69 R7.2 | 24.59,3.17 24.73,2.75 v24.93,2.82 | 24.59,3.17 25,3.02 v24.93,2.82 | 37.5,2.85 37.31,2.44 v37.5,2.35 | 37.5,2.85 37.69,2.44 v37.5,2.35
  Bottom 0.254: 25.32,2.51 28.01,2.51 28.3,2.8 30.55,2.8 32.35,1 36.15,1 37.15,2 | 25.32,2.51 25.24,2.51 v24.93,2.82 | 37.15,2 v37.5,2.35 | 25.32,2.51 25.12,2.91 v24.93,2.82 | 25.32,2.51 24.88,2.61 v24.93,2.82 | 37.15,2 37.57,2.15 v37.5,2.35 | 37.15,2 37.3,2.42 v37.5,2.35
CH4  (via drill 0.33, 0.33 pad 0.25)
  Top 0.254: STM32F103RET6.61 25.59,3.69 25.89,3.4 | v26.35,3.2 26.1,3.2 25.89,3.4 | R13.2 39.53,11.19 39.25,10.9 38.9,10.9 38.75,10.75 38.75,8.85 38.2,8.3 38.2,6.3 37.75,5.85 37.75,3.9 37.05,3.2 37.05,2.9 36.74,2.59 | 36.74,2.59 36.5,2.35 v36.3,2.35 | 25.89,3.4 26.19,3.06 v26.35,3.2 | 25.89,3.4 26.34,3.42 v26.35,3.2 | 36.74,2.59 36.29,2.57 v36.3,2.35 | 36.74,2.59 36.48,2.22 v36.3,2.35
  Bottom 0.254: 26.82,3.05 27.85,3.05 28.1,3.3 30.8,3.3 32.65,1.46 35.41,1.46 35.95,2 | 26.82,3.05 26.5,3.05 v26.35,3.2 | v36.3,2.35 35.95,2 | 26.82,3.05 26.5,3.36 v26.35,3.2 | 26.82,3.05 26.38,2.99 v26.35,3.2 | 35.95,2 36.37,2.15 v36.3,2.35 | 35.95,2 36.1,2.42 v36.3,2.35
CH5  (via drill 0.33)
  Top 0.254: R14.2 39.53,13.73 39.2,13.4 38.85,13.4 38.7,13.25 38.7,11.35 38.25,10.9 38.25,9 37.75,8.5 37.75,6.5 37.3,6.05 37.3,4.1 36.55,3.35 35.93,3.35 | 35.93,3.35 35.75,3.35 v35.5,3.1 | v25.7,6.15 25.7,5.8 25.83,5.67 | 25.83,5.67 26.05,5.45 26.05,4.38 STM32F103RET6.62 | 35.93,3.35 35.48,3.31 v35.5,3.1 | 35.93,3.35 35.68,2.98 v35.5,3.1 | 25.83,5.67 25.91,6.11 v25.7,6.15 | 25.83,5.67 25.54,6.01 v25.7,6.15
  Bottom 0.254: v35.5,3.1 35.5,2.6 | 35.5,2.6 35.5,2.4 35,1.9 32.9,1.9 31.05,3.75 29.75,3.75 27.1,6.4 26.13,6.4 | 26.13,6.4 25.95,6.4 v25.7,6.15 | 35.5,2.6 35.69,3.01 v35.5,3.1 | 35.5,2.6 35.31,3.01 v35.5,3.1 | 26.13,6.4 25.68,6.37 v25.7,6.15 | 26.13,6.4 25.88,6.03 v25.7,6.15
CH6
  Top 0.254: R15.2 39.53,16.29 39.2,15.95 38.7,15.95 38.4,15.65 38.4,13.6 38.2,13.4 38.2,12.6 37.3,11.7 31.55,11.7 30.35,12.8 STM32F103RET6.14
CH7
  Top 0.254: R16.2 39.53,18.84 39.2,18.5 38.65,18.5 38.3,18.15 38.3,16.25 37.85,15.8 37.85,13.8 37.7,13.65 37.7,12.85 37.05,12.15 31.75,12.15 30.55,13.3 STM32F103RET6.15
CH8
  Top 0.254: R35.2 39.53,21.39 39.2,21.05 38.9,21.05 38.65,20.8 38.65,19.15 37.8,18.3 37.8,16.4 37.35,15.95 37.35,14 37.1,13.75 37.1,13.05 36.7,12.65 31.85,12.65 30.7,13.8 STM32F103RET6.16
CH9
  Top 0.254: R36.2 39.53,23.73 39.4,23.6 38.9,23.6 38.6,23.3 38.6,21.45 38.2,21.05 38.2,19.35 37.3,18.45 37.3,16.7 36.85,16.25 36.85,14.25 36.6,14 36.6,13.3 36.45,13.15 32,13.15 30.85,14.3 28.15,14.3 27.85,14 27.85,13.35 27.1,12.6 22,12.6 21.55,13.05 20.8,13.05 20.55,12.8 20.55,11.35 19.5,10.3 STM32F103RET6.40
CH10
  Top 0.254: R37.2 39.5,27.46 39.5,26.25 39.35,26.1 38.8,26.1 38.15,25.45 38.15,21.75 37.75,21.35 37.75,19.55 36.85,18.65 36.85,16.95 36.4,16.5 36.4,14.5 36.15,14.25 36.15,13.8 36,13.65 32.25,13.65 31.1,14.8 28.35,14.8 27.85,15.3 27.85,16.25 27.6,16.5 27.3,16.5 27.09,16.29 STM32F103RET6.17
CH11  (via drill 0.33)
  Top 0.254: R38.2 39.55,30.04 39.55,28.85 39.35,28.65 39.05,28.65 38.7,28.3 38.7,26.6 37.65,25.55 37.65,24.6 37.15,24.1 26.75,24.1 26.25,23.6 26.25,21.75 27.35,20.65 27.35,18.64 | 27.35,18.64 v27.35,18.15 | v19,11.05 18.75,10.8 18.57,10.8 | 18.57,10.8 STM32F103RET6.39 | 27.35,18.64 27.16,18.24 v27.35,18.15 | 27.35,18.64 27.54,18.24 v27.35,18.15 | 18.57,10.8 19.02,10.84 v19,11.05 | 18.57,10.8 18.82,11.17 v19,11.05
  Bottom 0.254: v27.35,18.15 27.35,17.85 27.25,17.75 27.25,17.66 | 27.25,17.66 27.25,16.25 26.25,15.25 25.8,15.25 25.25,14.7 23.3,14.7 22.55,13.95 22.5,12.5 21.2,11.15 19.48,11.15 | 19.48,11.15 19.1,11.15 v19,11.05 | 27.25,17.66 27.52,18.02 v27.35,18.15 | 27.25,17.66 27.14,18.1 v27.35,18.15 | 19.48,11.15 19.05,11.26 v19,11.05 | 19.48,11.15 19.13,10.88 v19,11.05
GND  (via drill 0.33, 0.6)
  Top 0.254: 26.59,5.49 26.59,5.55 v26.8,5.72 | C4.1 24.68,1.32 24.45,1.1 24.45,0.8 24.3,0.65 21.9,0.65 21.7,0.85 21.7,1.47 R8.2 | STM32F103RET6.12 28.98,11.75 27.85,11.75 27.65,11.95 25.2,11.95 | 25.2,11.95 v24.7,11.95 | v22.4,19.55 22.35,19.5 21.91,19.5 | 21.91,19.5 21.6,19.5 20.77,18.66 C18.2 | STM32F103RET6.18 26.6,15.73 26.6,14.7 27.05,14.7 | 27.05,14.7 v27.55,14.7 | STM32F103RET6.31 20.1,15.73 20.1,14.85 19.95,14.7 | 19.95,14.7 19.65,14.4 v19.55,14.4 | MPU9150.11 12.45,17.55 12.75,17.25 12.92,17.25 | 12.92,17.25 13.45,17.25 13.45,17.48 | 13.45,17.48 MPU9150.9 | MPU9150.1 14.43,14.82 14,15.25 | 14,15.25 v13.65,15.6 | MPU9150.15 11.22,16.3 12,16.3 12.2,16.1 12.2,15.5 12.02,15.32 MPU9150.17 | STM32F103RET6.47 18.85,6.8 | v15.55,9.4 15.4,9.4 15.13,9.13 | 15.13,9.13 15.05,9.05 C23.2 | STM32F103RET6.63 26.59,5.27 | 26.59,5.27 26.59,5.49 | 26.59,5.49 26.8,5.7 | 26.59,5.27 26.93,5.55 v26.8,5.72 | 26.59,5.27 26.58,5.72 v26.8,5.72 | 25.2,11.95 24.79,12.14 v24.7,11.95 | 25.2,11.95 24.79,11.76 v24.7,11.95 | 15.13,9.13 15.58,9.19 v15.55,9.4 | 15.13,9.13 15.37,9.51 v15.55,9.4 | 21.91,19.5 22.33,19.35 v22.4,19.55 | 21.91,19.5 22.29,19.73 v22.4,19.55 | 27.05,14.7 27.46,14.51 v27.55,14.7 | 27.05,14.7 27.46,14.89 v27.55,14.7 | 19.95,14.7 19.51,14.61 v19.55,14.4 | 19.95,14.7 19.74,14.3 v19.55,14.4 | 14,15.25 13.85,15.67 v13.65,15.6 | 14,15.25 13.58,15.4 v13.65,15.6 | 12.92,17.25 13.17,16.88 v13.35,17 | 12.92,17.25 13.37,17.21 v13.35,17 | 13.45,17.48 13.18,17.13 v13.35,17 | 13.45,17.48 13.56,17.05 v13.35,17
  Bottom 0.254: RFM95.8 24.13,16 23,16 22.2,15.2 22.2,15.04 | 22.2,15.04 v22.2,14.55 | NRF24L01_SMD.P$1 34.06,2.8 33.25,2.8 33.13,2.92 | 33.13,2.92 33,3.05 v33,3.4 | 22.2,15.04 22.01,14.64 v22.2,14.55 | 22.2,15.04 22.39,14.64 v22.2,14.55 | 33.13,2.92 33.21,3.36 v33,3.4 | 33.13,2.92 32.84,3.26 v33,3.4
  other vias: 28.05,4.05 28.9,5.6 35.75,7.3 30.45,26.7 38,28.7 25.9,29.9 36.75,10.2 34.2,15.95 29.9,15.45 11.55,2.55 16.6,4.9 21.6,21.95 12.5,23.4 20.65,1.75 11.5,6.15 16.9,21.9
  pour Bottom (rank 2): 0.48,31.64 50.38,31.64 50.38,0.5 0.48,0.5
  pour Top: 0.48,31.64 50.38,31.64 50.38,0.5 0.48,0.5
  pour Route15: 0.48,31.64 50.38,31.64 50.38,0.5 0.48,0.5
HOPERF_DIO0  (via drill 0.33)
  Top 0.254: v21.2,26.65 21.7,26.65 | 21.7,26.65 22.1,26.65 22.4,26.35 23.9,26.35 24.5,25.75 24.5,22.9 23.3,21.7 22.4,21.7 21.7,21 21.7,20.64 | 21.7,20.64 v21.7,20.15 | v21.2,12.4 21.45,12.15 21.63,12.15 | 21.63,12.15 23.5,12.15 24.4,11.25 26.85,11.25 28.3,9.8 STM32F103RET6.8 | 21.7,26.65 21.29,26.84 v21.2,26.65 | 21.7,26.65 21.29,26.46 v21.2,26.65 | 21.7,20.64 21.51,20.24 v21.7,20.15 | 21.7,20.64 21.89,20.24 v21.7,20.15 | 21.63,12.15 21.38,12.52 v21.2,12.4 | 21.63,12.15 21.18,12.19 v21.2,12.4
  Bottom 0.254: RFM95.14 20.62,26.07 20.85,26.3 | 20.85,26.3 v21.2,26.65 | v21.7,20.15 21.4,19.85 21.4,19.76 | 21.4,19.76 21.4,14.45 21.2,14.25 21.2,12.89 | 21.2,12.89 v21.2,12.4 | 20.85,26.3 21.27,26.45 v21.2,26.65 | 20.85,26.3 21,26.72 v21.2,26.65 | 21.4,19.76 21.8,19.96 v21.7,20.15 | 21.4,19.76 21.49,20.19 v21.7,20.15 | 21.2,12.89 21.01,12.49 v21.2,12.4 | 21.2,12.89 21.39,12.49 v21.2,12.4
HOPERF_DIO1  (via drill 0.33)
  Top 0.254: v26.95,23.35 27.3,23 | 27.3,23 27.9,22.4 27.9,18.6 28.7,17.85 29.6,17.85 29.8,18.05 31.35,18.05 31.55,17.85 32.3,17.15 32.3,16.64 | 32.3,16.64 v32.3,16.15 | v30.9,11.2 30.41,11.2 | 30.41,11.2 30.1,11.2 30,11.3 STM32F103RET6.11 | 27.3,23 27.15,23.42 v26.95,23.35 | 27.3,23 26.88,23.15 v26.95,23.35 | 32.3,16.64 32.11,16.24 v32.3,16.15 | 32.3,16.64 32.49,16.24 v32.3,16.15 | 30.41,11.2 30.81,11.01 v30.9,11.2 | 30.41,11.2 30.81,11.39 v30.9,11.2
  Bottom 0.254: RFM95.15 8.23,28.1 14.55,28.1 15,27.65 21.75,27.65 22.4,28.3 22.4,28.85 22.6,29.05 25.7,29.05 26.2,28.55 26.2,24.05 26.58,23.67 | 26.58,23.67 26.9,23.35 v26.95,23.35 | v32.3,16.15 32.6,15.85 32.6,15.76 | 32.6,15.76 32.6,12.05 31.75,11.2 31.39,11.2 | 31.39,11.2 v30.9,11.2 | 26.58,23.67 26.75,23.27 v26.95,23.35 | 26.58,23.67 27.01,23.56 v26.95,23.35 | 32.6,15.76 32.51,16.19 v32.3,16.15 | 32.6,15.76 32.2,15.96 v32.3,16.15 | 31.39,11.2 30.99,11.39 v30.9,11.2 | 31.39,11.2 30.99,11.01 v30.9,11.2
HOPERF_DIO2  (via drill 0.33)
  Top 0.254: v21.05,28.35 21.4,28 | 21.4,28 22.3,27.1 25.3,27.1 25.65,26.75 25.65,19 24.9,18.25 24.9,17.8 24.55,17.45 23.2,17.45 22.59,16.84 STM32F103RET6.26 | 21.4,28 21.25,28.42 v21.05,28.35 | 21.4,28 20.98,28.15 v21.05,28.35
  Bottom 0.254: RFM95.16 8.33,30.2 16,30.2 17.85,28.35 20.55,28.35 | 20.55,28.35 v21.05,28.35 | 20.55,28.35 20.96,28.16 v21.05,28.35 | 20.55,28.35 20.96,28.54 v21.05,28.35
HOPERF_DIO3  (via drill 0.33)
  Top 0.254: v6,19.8 6,19.3 | 6,19.3 6,13.29 | 6,13.29 v6,12.8 | v17.25,3.55 17.6,3.55 17.73,3.68 | 17.73,3.68 18.6,4.55 18.6,5.1 19.25,5.75 19.8,5.75 20.1,5.45 20.1,4.33 STM32F103RET6.50 | 6,19.3 6.19,19.71 v6,19.8 | 6,19.3 5.81,19.71 v6,19.8 | 6,13.29 5.81,12.89 v6,12.8 | 6,13.29 6.19,12.89 v6,12.8 | 17.73,3.68 17.29,3.76 v17.25,3.55 | 17.73,3.68 17.39,3.39 v17.25,3.55
  Bottom 0.254: RFM95.11 6.42,20.07 | 6.42,20.07 6.27,20.07 v6,19.8 | v6,12.8 6,12.3 | 6,12.3 6,12.15 7.25,10.9 7.25,4.9 7.65,4.5 10.55,4.5 11,4.95 15.15,4.95 16.55,3.55 16.75,3.55 | 16.75,3.55 v17.25,3.55 | 6.42,20.07 5.97,20.01 v6,19.8 | 6.42,20.07 6.18,19.69 v6,19.8 | 6,12.3 6.19,12.71 v6,12.8 | 6,12.3 5.81,12.71 v6,12.8 | 16.75,3.55 17.16,3.36 v17.25,3.55 | 16.75,3.55 17.16,3.74 v17.25,3.55
HOPERF_DIO4  (via drill 0.33)
  Top 0.254: v5.35,20.9 5.35,20.41 | 5.35,20.41 5.35,12.9 3.4,10.95 3.4,6.59 | 3.4,6.59 v3.4,6.1 | v21.2,2.7 21.5,3 21.5,3.09 | 21.5,3.09 21.5,3.45 21.6,3.55 21.6,4.33 STM32F103RET6.53 | 5.35,20.41 5.54,20.81 v5.35,20.9 | 5.35,20.41 5.16,20.81 v5.35,20.9 | 3.4,6.59 3.21,6.19 v3.4,6.1 | 3.4,6.59 3.59,6.19 v3.4,6.1 | 21.5,3.09 21.1,2.89 v21.2,2.7 | 21.5,3.09 21.41,2.66 v21.2,2.7
  Bottom 0.254: RFM95.12 6.52,22.07 5.7,21.25 | 5.7,21.25 v5.35,20.9 | v3.4,6.1 3.4,5.61 | 3.4,5.61 3.4,4.7 4.15,3.95 9.9,3.95 10.65,3.2 14.7,3.2 15.5,2.4 20.81,2.4 | 20.81,2.4 20.9,2.4 v21.2,2.7 | 5.7,21.25 5.28,21.1 v5.35,20.9 | 5.7,21.25 5.55,20.83 v5.35,20.9 | 3.4,5.61 3.59,6.01 v3.4,6.1 | 3.4,5.61 3.21,6.01 v3.4,6.1 | 20.81,2.4 21.24,2.49 v21.2,2.7 | 20.81,2.4 21.01,2.8 v21.2,2.7
HOPERF_DIO5  (via drill 0.33)
  Top 0.254: v25.7,18.15 25.95,18 25.95,17.75 25.89,17.69 | 25.89,17.69 25.1,16.9 23.4,16.9 23.09,16.59 STM32F103RET6.25 | 25.89,17.69 25.92,18.14 v25.7,18.15 | 25.89,17.69 25.56,17.99 v25.7,18.15
  Bottom 0.254: 24.18,18.05 RFM95.7 24.28,18.15 25.2,18.15 | 25.2,18.15 v25.7,18.15 | 25.2,18.15 25.61,17.96 v25.7,18.15 | 25.2,18.15 25.61,18.34 v25.7,18.15
I2C2_SCL  (via drill 0.33)
  Top 0.254: MPU9150.23 13.95,13.6 12.85,12.5 12.85,11.53 R3.2 12.8,10.75 13.1,10.45 15.3,10.45 15.95,11.1 16,11.1 | STM32F103RET6.29 21.1,15.73 21.1,14.05 19.8,12.75 | 19.8,12.75 v19.45,12.4 | v16.5,11.1 16,11.1 | 19.8,12.75 19.38,12.6 v19.45,12.4 | 19.8,12.75 19.65,12.33 v19.45,12.4 | 16,11.1 16.41,10.91 v16.5,11.1 | 16,11.1 16.41,11.29 v16.5,11.1
  Bottom 0.254: v19.45,12.4 18.95,12.4 | 18.95,12.4 17.8,12.4 16.85,11.45 | 16.85,11.45 v16.5,11.1 | 18.95,12.4 19.36,12.21 v19.45,12.4 | 18.95,12.4 19.36,12.59 v19.45,12.4 | 16.85,11.45 16.43,11.3 v16.5,11.1 | 16.85,11.45 16.7,11.03 v16.5,11.1
I2C2_SDA  (via drill 0.33)
  Top 0.254: 17.48,14.93 R11.1 17.52,16.3 | 17.48,14.93 17.15,14.6 16.1,14.6 15.05,13.55 14.45,13.55 MPU9150.24 | v20.35,17 20.59,16.77 20.59,16.56 | 20.59,16.56 STM32F103RET6.30 | v18,15.15 17.77,14.93 17.56,14.93 | 17.56,14.93 17.48,14.93 | 20.59,16.56 20.57,17.01 v20.35,17 | 20.59,16.56 20.22,16.82 v20.35,17 | 17.56,14.93 18,14.93 v18,15.15 | 17.56,14.93 17.83,15.28 v18,15.15
  Bottom 0.254: 19.86,17 19.25,17 18.6,16.3 18,15.7 18,15.64 | 19.86,17 v20.35,17 | 18,15.64 v18,15.15 | 19.86,17 20.26,16.81 v20.35,17 | 19.86,17 20.26,17.19 v20.35,17 | 18,15.64 17.81,15.24 v18,15.15 | 18,15.64 18.19,15.24 v18,15.15
INP_1
  Top 0.254: SETUP.3 26.85,30.35 26.4,30.8 21.06,30.8 20.61,30.35 SETUP.4 19.65,30.29 19.65,29.05 19.09,28.49 C19.2 R20.1 17.34,26.8 16.45,26.8 16.15,26.5 16.15,24.75 16.7,24.2 17.2,24.2 17.55,23.85 17.55,19.85 17.75,19.65 18.55,19.65 18.95,19.25 18.95,18.25 18.8,18.1 18.8,14 18.6,13.8 STM32F103RET6.33
LED_GREEN  (via drill 0.33)
  Top 0.254: v27.95,17.5 27.45,17.5 | 27.45,17.5 26.3,17.5 25.59,16.79 STM32F103RET6.20 | 27.45,17.5 27.86,17.31 v27.95,17.5 | 27.45,17.5 27.86,17.69 v27.95,17.5
  Bottom 0.254: R23.2 28.6,17.95 28.39,17.74 | 28.39,17.74 28.15,17.5 v27.95,17.5 | 28.39,17.74 27.94,17.72 v27.95,17.5 | 28.39,17.74 28.12,17.37 v27.95,17.5
LED_RED  (via drill 0.33)
  Top 0.254: STM32F103RET6.27 22.1,15.77 22.1,17.15 | 22.1,17.15 22.1,17.4 v22.3,17.6 | 22.1,17.15 22.44,17.43 v22.3,17.6 | 22.1,17.15 22.08,17.59 v22.3,17.6
  Bottom 0.254: R25.2 27.9,23.35 26.6,22.05 26.6,17.85 25.85,17.1 23,17.1 22.74,17.36 | 22.74,17.36 22.5,17.6 v22.3,17.6 | 22.74,17.36 22.48,17.73 v22.3,17.6 | 22.74,17.36 22.29,17.38 v22.3,17.6
MPU_INT  (via drill 0.33)
  Top 0.254: MPU9150.12 11.95,18.57 | 11.95,18.57 11.95,18.7 v11.7,19 | v16.1,8.15 16.25,8.3 16.57,8.3 | 16.57,8.3 STM32F103RET6.44 | 11.95,18.57 11.91,19.02 v11.7,19 | 11.95,18.57 11.58,18.82 v11.7,19 | 16.57,8.3 16.13,8.36 v16.1,8.15 | 16.57,8.3 16.25,7.99 v16.1,8.15
  Bottom 0.254: v11.7,19 11.4,19 11.23,18.83 | 11.23,18.83 11.15,18.75 11.15,8.35 11.65,7.85 15.71,7.85 | 15.71,7.85 15.8,7.85 v16.1,8.15 | 11.23,18.83 11.68,18.79 v11.7,19 | 11.23,18.83 11.55,19.15 v11.7,19 | 15.71,7.85 16.14,7.94 v16.1,8.15 | 15.71,7.85 15.91,8.25 v16.1,8.15
N$1
  Top 0.254: C1.1 34.62,4.38 34.3,4.05 | 34.3,4.05 34.2,3.15 XTAL.3 | STM32F103RET6.5 29.75,8.3 30.5,7.55 30.5,5.75 30.85,5.4 32.95,5.4 34.3,4.05
N$2
  Top 0.254: STM32F103RET6.6 29.95,8.8 30.5,8.25 31.8,8.25 32.21,8.66 R5.1
N$3
  Top 0.254: XTAL.1 32.15,6.8 33,7.65 33,7.95 33.45,8.4 33.45,8.6 33.8,8.95 | 33.8,8.95 C2.1 | R5.2 33.15,10.65 33.5,10.3 33.5,9.25 33.8,8.95
N$4
  Top 0.254: STM32F103RET6.60 25.1,4.29 25.1,3.59 25.65,3.05 25.65,2.55 25.25,2.15 24.65,2.15 24.05,1.55 23.48,1.55 R8.1
N$5
  Top 0.254: 2N2222_TX.C 10.3,26.55 10,26.85 9.8,26.85 9.45,27.2 R10.2 9.5,27.96 9.5,29 9.8,29.3 10.7,29.3 11.15,29.75 R2.2
N$7
  Bottom 1.27: RFM95.9 RP-SMA.P
N$8
  Top 0.254: 2N2222_TX.B 9.45,23.3 R12.1
N$9
  Top 0.254: CH0.3 43.32,2.05 R24.1
N$10
  Bottom 0.254: PWR.A 31.96,29 31.35,29 31.15,29.2 31.15,29.8 30.96,29.98 R18.2
N$11
  Top 0.254: 2N2222_TX1.C R21.2 10.25,2.35 9.8,2.8 8.95,2.8 8.55,3.2 R22.2
N$12
  Bottom 0.254: G.A 28.2,26.4 28.35,26.25 29.1,26.25 29.7,25.65 29.7,21.75 29.45,21.5 R23.1
N$13
  Top 0.254: CH8.3 R35.1
N$14
  Top 0.254: SPORT.1 2.04,30.57 R1.1 5,30.61 5,31.25 5.2,31.45 9.1,31.45 9.45,31.1 R2.1
N$15
  Bottom 0.254: R.A 26.95,28.35 26.95,25.55 27.45,25.05 R25.1
N$16
  Top 0.254: R1.2 6.76,30.48 2N2222_RX.B
N$17  (via drill 0.33)
  Top 0.254: C8.1 C9.1 33.4,16.38 32.98,15.96 32.98,14.9 | 32.8,14.52 32.8,14.8 32.98,14.8 FCM1608-0603.2 32.98,14.9 | STM32F103RET6.13 29.95,12.3 | 29.95,12.3 | 29.95,12.3 v30.3,11.95 | v31.7,15.3 32,15.3 32.17,15.13 | 32.17,15.13 32.4,14.9 32.98,14.9 | 29.95,12.3 30.1,11.88 v30.3,11.95 | 29.95,12.3 30.37,12.15 v30.3,11.95 | 32.17,15.13 31.85,15.45 v31.7,15.3 | 32.17,15.13 31.72,15.09 v31.7,15.3
  Bottom 0.254: v30.3,11.95 30.8,11.95 | 30.8,11.95 31,11.95 31.3,12.25 31.3,14.9 31.35,14.95 | v31.7,15.3 31.35,14.95 | 30.8,11.95 30.39,12.14 v30.3,11.95 | 30.8,11.95 30.39,11.76 v30.3,11.95 | 31.35,14.95 31.77,15.1 v31.7,15.3 | 31.35,14.95 31.5,15.37 v31.7,15.3
N$21
  Top 0.254: CH2.3 43.34,7.15 R6.1
N$23
  Top 0.254: CH4.3 R13.1
N$25
  Top 0.254: CH9.3 R36.1
N$26
  Top 0.254: CH10.3 R37.1
N$27
  Top 0.254: CH11.3 R38.1
N$28
  Top 0.254: R40.1 14.45,23.12 MS5611.8 14.45,23.07 14.45,22.25 13.8,21.6 13.8,19.95 14.45,19.3 MPU9150.7
N$29
  Top 0.254: R39.2 15.45,30.2 15.65,30 15.65,23.12 MS5611.7 15.7,23.07 15.7,22.2 16.25,21.65 16.25,19.8 15.95,19.5 15.95,17.55 15.72,17.32 MPU9150.6
N$31
  Top 0.254: CH3.3 43.35,9.7 R7.1
N$32
  Top 0.254: CH6.3 43.33,17.3 R15.1
N$33
  Top 0.254: MPU9150.20 12.45,13.2 12,12.75 12,9.2 12.15,9.05 C23.1
N$34
  Top 0.254: CH5.3 R14.1
N$35
  Top 0.254: CH7.3 R16.1
N$40
  Top 0.254: C24.1 10.1,18.3 11.45,19.65 12.2,19.65 12.95,18.75 MPU9150.10
N$53
  Top 0.254: CH1.3 R4.1
NRF_CE  (via drill 0.33)
  Top 0.254: v30.75,10.3 30.4,10.3 30.27,10.43 | 30.27,10.43 29.9,10.8 STM32F103RET6.10 | 30.27,10.43 30.61,10.14 v30.75,10.3 | 30.27,10.43 30.71,10.51 v30.75,10.3
  Bottom 0.254: NRF24L01_SMD.P$7 32.93,10.38 32.8,10.25 31.24,10.25 | 31.24,10.25 30.8,10.25 v30.75,10.3 | 31.24,10.25 30.86,10.48 v30.75,10.3 | 31.24,10.25 30.82,10.1 v30.75,10.3
NRF_CSN  (via drill 0.33)
  Top 0.254: v30.8,9.25 30.45,9.6 | 30.45,9.6 29.75,10.3 STM32F103RET6.9 | 30.45,9.6 30.6,9.18 v30.8,9.25 | 30.45,9.6 30.87,9.45 v30.8,9.25
  Bottom 0.254: NRF24L01_SMD.P$6 31.27,9.11 | 31.27,9.11 30.94,9.11 v30.8,9.25 | 31.27,9.11 30.95,9.41 v30.8,9.25 | 31.27,9.11 30.84,9.04 v30.8,9.25
NRF_IRQ  (via drill 0.33)
  Top 0.254: v23.35,13.75 23.35,14.2 23.39,14.24 | 23.39,14.24 23.55,14.4 23.55,15.71 STM32F103RET6.24 | 23.39,14.24 23.16,13.86 v23.35,13.75 | 23.39,14.24 23.55,13.83 v23.35,13.75
  Bottom 0.254: NRF24L01_SMD.P$2 33.67,4.03 32.05,5.65 30.4,5.65 28.8,7.25 26.75,7.25 25.4,8.6 25.4,12.8 25,13.2 23.9,13.2 23.7,13.4 | 23.7,13.4 v23.35,13.75 | 23.7,13.4 23.55,13.82 v23.35,13.75 | 23.7,13.4 23.28,13.55 v23.35,13.75
NSRST  (via drill 0.33)
  Top 0.254: STM32F103RET6.7 28.24,9.3 | 28.24,9.3 27.85,9.3 v27.75,9.35 | R9.2 28.93,18.88 28.95,18.85 | 28.95,18.85 v29.3,18.5 | 28.24,9.3 27.86,9.53 v27.75,9.35 | 28.24,9.3 27.82,9.15 v27.75,9.35 | 28.95,18.85 29.1,18.43 v29.3,18.5 | 28.95,18.85 29.37,18.7 v29.3,18.5
  Bottom 0.254: v27.75,9.35 27.75,9.85 | 27.75,9.85 27.75,12.05 29.15,13.45 29.15,17.45 29.3,17.6 29.3,18 | 29.3,18 v29.3,18.5 | 27.75,9.85 27.56,9.44 v27.75,9.35 | 27.75,9.85 27.94,9.44 v27.75,9.35 | 29.3,18 29.49,18.41 v29.3,18.5 | 29.3,18 29.11,18.41 v29.3,18.5
SBUS
  Top 0.254: SBUS.1 3.96,0.65 6.95,0.65 7.85,1.55 R21.1
SPI1_MISO  (via drill 0.33)
  Top 0.254: v24.8,13.9 24.8,14.39 | 24.8,14.39 24.8,14.4 24.6,14.6 24.6,15.73 STM32F103RET6.22 | 24.8,14.39 24.61,13.99 v24.8,13.9 | 24.8,14.39 24.99,13.99 v24.8,13.9
  Bottom 0.254: NRF24L01_SMD.P$3 33.4,5.3 33,5.7 32.6,5.7 32.2,6.1 30.6,6.1 29,7.7 27,7.7 25.95,8.75 25.95,13.1 25.35,13.7 25.25,13.7 | 25.25,13.7 25,13.7 v24.8,13.9 | 25.25,13.7 24.96,14.04 v24.8,13.9 | 25.25,13.7 24.81,13.68 v24.8,13.9
SPI1_MOSI  (via drill 0.33)
  Top 0.254: STM32F103RET6.23 24.1,15.73 24.1,13.25 24.3,13.05 25.05,13.05 25.45,13.45 26.3,13.45 | 26.3,13.45 v26.8,13.45 | 26.3,13.45 26.71,13.26 v26.8,13.45 | 26.3,13.45 26.71,13.64 v26.8,13.45
  Bottom 0.254: NRF24L01_SMD.P$4 30.83,6.57 29.25,8.15 27.25,8.15 26.5,8.9 26.5,12.25 26.95,12.7 26.95,12.98 | v26.8,13.45 26.95,13.3 26.95,12.98 | 26.95,12.98 27.01,13.42 v26.8,13.45 | 26.95,12.98 26.64,13.3 v26.8,13.45
SPI1_SCK  (via drill 0.33)
  Top 0.254: v25.8,14.25 25.7,14.25 25.4,14.55 | 25.4,14.55 25.1,14.85 25.1,15.73 STM32F103RET6.21 | 25.4,14.55 25.61,14.15 v25.8,14.25 | 25.4,14.55 25.84,14.46 v25.8,14.25
  Bottom 0.254: NRF24L01_SMD.P$5 30.41,7.84 29.6,8.65 27.45,8.65 27.05,9.05 27.05,12.05 27.55,12.55 27.55,13.75 27.15,14.15 26.29,14.15 | 26.29,14.15 25.9,14.15 v25.8,14.25 | 26.29,14.15 25.93,14.42 v25.8,14.25 | 26.29,14.15 25.85,14.04 v25.8,14.25
SPI2_MISO  (via drill 0.33)
  Top 0.254: v14.85,12.8 15.35,12.8 | 15.35,12.8 STM32F103RET6.35 | 15.35,12.8 14.94,12.99 v14.85,12.8 | 15.35,12.8 14.94,12.61 v14.85,12.8
  Bottom 0.254: RFM95.2 24.18,28.05 22.85,28.05 22.3,27.5 22.3,26.35 21.45,25.5 21.45,24.55 14.4,17.5 14.4,13.1 14.43,13.06 | 14.43,13.06 14.65,12.8 v14.85,12.8 | 14.43,13.06 14.67,12.69 v14.85,12.8 | 14.43,13.06 14.87,13.02 v14.85,12.8
SPI2_MOSI  (via drill 0.33)
  Top 0.254: STM32F103RET6.36 16.85,12.3 16.62,12.07 | 16.62,12.07 16.45,11.9 v16.15,11.9 | 16.62,12.07 16.17,12.12 v16.15,11.9 | 16.62,12.07 16.3,11.75 v16.15,11.9
  Bottom 0.254: RFM95.3 24.08,25.95 22.65,25.95 22,25.3 22,24.3 15.7,18 15.7,14.45 15.4,14.15 15.4,13.55 15.7,13.25 15.7,12.11 | v16.15,11.9 15.9,11.9 15.7,12.1 15.7,12.11 | 15.7,12.11 15.98,11.76 v16.15,11.9 | 15.7,12.11 16.15,12.12 v16.15,11.9
SPI2_SCK  (via drill 0.33)
  Top 0.254: v16.2,13.75 16.55,13.4 | 16.55,13.4 16.65,13.3 STM32F103RET6.34 | 16.55,13.4 16.4,13.82 v16.2,13.75 | 16.55,13.4 16.13,13.55 v16.2,13.75
  Bottom 0.254: RFM95.4 24.13,24 22.4,24 16.2,17.8 16.2,14.24 | 16.2,14.24 v16.2,13.75 | 16.2,14.24 16.01,13.84 v16.2,13.75 | 16.2,14.24 16.39,13.84 v16.2,13.75
SWCLK
  Top 0.254: SWD.2 5.32,5.2 7.25,5.2 7.45,5.4 15.05,5.4 16.2,4.25 16.2,2.6 16,2.4 16,1.59 | STM32F103RET6.49 19.59,3.63 19.2,3.25 18.4,3.25 18,2.85 18,1.9 17.6,1.5 16.36,1.5 16.27,1.59 16,1.59 | 16,1.59 Z5V1_D2.C
SWDIO
  Top 0.254: SWD.4 7.05,10.25 7.55,9.75 7.55,7.45 8.47,6.53 Z5V1_D1.C 9.44,6.55 10.65,6.55 11.65,7.55 15.7,7.55 15.95,7.3 STM32F103RET6.46
USART1_RX
  Top 0.254: 2N2222_RX.C 5.85,25.91 5.85,24.75 6.05,24.55 6.3,24.55 6.66,24.19 R17.2 6.66,11.44 8.1,10 8.1,8.95 8.95,8.1 15.1,8.1 15.8,8.8 STM32F103RET6.43
USART1_TX  (via drill 0.33)
  Top 0.254: R12.2 12,21.1 | 12,21.1 | 12,21.1 v12.35,20.75 | v16.3,9.85 16.3,9.8 16.62,9.48 | 16.62,9.48 16.8,9.3 STM32F103RET6.42 | 12,21.1 12.15,20.68 v12.35,20.75 | 12,21.1 12.42,20.95 v12.35,20.75 | 16.62,9.48 16.51,9.91 v16.3,9.85 | 16.62,9.48 16.21,9.65 v16.3,9.85
  Bottom 0.254: v12.35,20.75 12.35,20.25 | 12.35,20.25 12.35,15 11.8,14.45 11.8,10.65 12.25,10.2 15.95,10.2 | 15.95,10.2 | 15.95,10.2 v16.3,9.85 | 12.35,20.25 12.54,20.66 v12.35,20.75 | 12.35,20.25 12.16,20.66 v12.35,20.75 | 15.95,10.2 16.1,9.78 v16.3,9.85 | 15.95,10.2 16.37,10.05 v16.3,9.85
USART3_TX  (via drill 0.33)
  Top 0.254: 2N2222_TX1.B 14.65,3.65 15.12,3.65 | 15.12,3.65 15.3,3.65 v15.55,3.4 | v20.45,3.1 20.59,3.23 20.59,3.58 | 20.59,3.58 STM32F103RET6.51 | 15.12,3.65 15.37,3.28 v15.55,3.4 | 15.12,3.65 15.57,3.62 v15.55,3.4 | 20.59,3.58 20.29,3.24 v20.45,3.1 | 20.59,3.58 20.66,3.14 v20.45,3.1
  Bottom 0.254: v15.55,3.4 15.9,3.05 | 15.9,3.05 16.1,2.85 20.02,2.85 | 20.02,2.85 20.2,2.85 v20.45,3.1 | 15.9,3.05 15.75,3.47 v15.55,3.4 | 15.9,3.05 15.48,3.2 v15.55,3.4 | 20.02,2.85 20.47,2.88 v20.45,3.1 | 20.02,2.85 20.27,3.22 v20.45,3.1
V+
  Top 1.422: CH0.2 CH1.2 CH2.2 CH3.2 CH4.2 CH5.2 CH6.2 CH7.2 CH8.2 CH9.2 CH10.2 CH11.2
  Route2 0.61: SBUS.2 3.3,3.85 3.3,1.25 3.7,0.85 | 3.73,0.82 3.7,0.85 | 3.7,0.85 27,0.85 28.95,2.8 32,2.8 33.95,0.85 44.75,0.85 45.91,2.01 CH0.2
  Bottom 0.406: 40.35,8.45 40.3,8.45 | 40.3,12 40.25,12 | 45.91,1.96 CH0.2 | 40.7,1.8 C5.+
  Bottom 0.61: CH11.2 44.55,31.4 40.5,31.4 40.05,30.95 | 40.05,29.85 C7.1 BAT60JFILM.A 40.15,29.75 40.05,29.85 | C22.1 40.3,8.45 40.85,9 40.85,11.45 40.3,12 | 40.25,12 C21.1 C20.1 | 40.35,8.45 41.35,7.45 41.35,2.45 40.7,1.8 41.7,0.75 44.65,0.75 45.91,1.96 | 40.05,29.85 40.05,30.95 | 40.05,30.95 39.6,31.4 4.55,31.4 3.85,30.7 3.85,28.85 2.95,27.95 SPORT.2
VCC  (via drill 0.33, 0.6)
  Top 0.254: STM32F103RET6.64 27.1,4.33 27.1,3.75 28.06,2.79 | 28.06,2.79 C17.1 29.99,2.79 30.7,3.5 30.7,4.05 | 28.06,2.79 27,1.73 C4.2 | FCM1608-0603.1 34.84,14.95 35.5,14.95 35.7,15.15 35.7,15.46 | 35.7,15.46 v35.7,15.95 | v30.7,4.55 30.7,4.05 | v30.7,4.55 30.35,4.9 | 30.35,4.9 30.05,5.2 30.05,5.9 29.65,6.3 STM32F103RET6.1 | C12.1 29.2,16.57 29.2,17.1 29.35,17.25 29.73,17.25 | 29.73,17.25 30.05,17.25 v30.2,17.4 | R17.1 4.92,23.7 4.1,23.7 3.79,24.01 | 3.79,24.01 3.75,24.05 v3.75,24.5 | R10.1 11.2,27.86 11.2,27.2 11.45,26.95 11.85,26.95 11.95,27.05 | 11.95,27.05 12.25,27.35 v12.35,27.35 | R39.1 14.4,28.45 13.05,28.45 12.44,27.84 | 12.44,27.84 12.35,27.75 v12.35,27.35 | R40.2 14.4,26.85 12.9,26.85 12.72,27.03 | 12.72,27.03 12.4,27.35 v12.35,27.35 | R20.2 17.41,25.05 18.15,25.05 18.4,24.8 | 18.4,24.8 18.6,24.6 v18.85,24.6 | v18.85,24.6 19.2,24.25 | 19.2,24.25 19.25,24.2 21.75,24.2 22.2,23.75 C25.1 | MS5611.1 14.45,20.68 14.45,20.05 14.76,19.74 | 14.76,19.74 15,19.5 v15.2,19.5 | MS5611.2 15.65,20.68 15.65,19.95 15.55,19.85 | 15.55,19.85 v15.2,19.5 | v13.75,19.1 13.95,18.9 13.95,18.65 | 13.95,18.65 MPU9150.8 13.95,17.3 14.05,17.2 14.05,16.25 14.5,15.8 15.18,15.8 MPU9150.3 | 17.57,18.05 R11.2 17.48,18.52 17.77,18.82 | v11.3,4.2 10.8,4.2 | 10.8,4.2 R22.1 | C14.1 14.66,6.4 15.11,6.4 | 15.11,6.4 v15.6,6.4 | v15.6,6.4 15.7,6.3 16.09,6.3 | 16.09,6.3 STM32F103RET6.48 | v18.25,18.95 17.9,18.95 17.77,18.82 | v20.8,21.45 20.45,21.1 | 20.45,21.1 20.25,20.9 C18.1 | STM32F103RET6.32 19.6,15.77 19.6,16.9 19.55,16.95 19.55,17.16 | 19.55,17.16 v19.55,17.65 | STM32F103RET6.19 26.1,15.77 26.1,16.45 26.18,16.58 | 26.18,16.58 26.5,16.85 v26.55,16.85
  Top 0.254: MPU9150.13 10.43,17.32 | 10.43,17.32 10.37,17.32 v10.05,17 | C16.1 C3.1 10.05,13.75 10.05,16.5 | v10.05,17 10.05,16.5 | R9.1 30.62,19.18 30.68,19.13 | 30.68,19.13 v31.05,18.8 | R3.1 14.5,12 14.25,12.25 | 14.25,12.25 v13.9,12.6 | 35.7,15.46 35.89,15.86 v35.7,15.95 | 35.7,15.46 35.51,15.86 v35.7,15.95 | 30.7,4.05 30.89,4.46 v30.7,4.55 | 30.7,4.05 30.51,4.46 v30.7,4.55 | 30.35,4.9 30.5,4.48 v30.7,4.55 | 30.35,4.9 30.77,4.75 v30.7,4.55 | 29.73,17.25 30.17,17.19 v30.2,17.4 | 29.73,17.25 30.05,17.56 v30.2,17.4 | 3.79,24.01 3.95,24.42 v3.75,24.5 | 3.79,24.01 3.56,24.39 v3.75,24.5 | 11.95,27.05 12.39,27.14 v12.35,27.35 | 11.95,27.05 12.16,27.45 v12.35,27.35 | 12.44,27.84 12.18,27.48 v12.35,27.35 | 12.44,27.84 12.56,27.41 v12.35,27.35 | 12.72,27.03 12.55,27.43 v12.35,27.35 | 12.72,27.03 12.29,27.14 v12.35,27.35 | 18.4,24.8 18.68,24.46 v18.85,24.6 | 18.4,24.8 18.84,24.82 v18.85,24.6 | 19.2,24.25 19.05,24.67 v18.85,24.6 | 19.2,24.25 18.78,24.4 v18.85,24.6 | 14.76,19.74 15.03,19.37 v15.2,19.5 | 14.76,19.74 15.21,19.72 v15.2,19.5 | 15.55,19.85 15.13,19.7 v15.2,19.5 | 15.55,19.85 15.4,19.43 v15.2,19.5 | 13.95,18.65 13.97,19.09 v13.75,19.1 | 13.95,18.65 13.61,18.93 v13.75,19.1 | 17.77,18.82 18.21,18.74 v18.25,18.95 | 17.77,18.82 18.11,19.11 v18.25,18.95 | 10.8,4.2 11.21,4.01 v11.3,4.2 | 10.8,4.2 11.21,4.39 v11.3,4.2 | 15.11,6.4 15.51,6.21 v15.6,6.4 | 15.11,6.4 15.51,6.59 v15.6,6.4 | 16.09,6.3 15.73,6.57 v15.6,6.4 | 16.09,6.3 15.65,6.19 v15.6,6.4 | 20.45,21.1 20.87,21.25 v20.8,21.45 | 20.45,21.1 20.6,21.52 v20.8,21.45 | 19.55,17.16 19.74,17.56 v19.55,17.65 | 19.55,17.16 19.36,17.56 v19.55,17.65 | 26.18,16.58 26.61,16.69 v26.55,16.85
  Top 0.254: 26.18,16.58 26.35,16.93 v26.55,16.85 | 14.25,12.25 14.1,12.67 v13.9,12.6 | 14.25,12.25 13.83,12.4 v13.9,12.6 | 10.43,17.32 10,17.21 v10.05,17 | 10.43,17.32 10.25,16.91 v10.05,17 | 10.05,16.5 10.24,16.91 v10.05,17 | 10.05,16.5 9.86,16.91 v10.05,17 | 30.68,19.13 30.85,18.72 v31.05,18.8 | 30.68,19.13 31.11,19.01 v31.05,18.8
  Top 0.61: C13.1 33.2,28.7 33.7,28.2 C15.1 34.35,26.71 34.35,26.05 | 34.35,26.05 v34.35,25.15 | 34.35,26.05 34.18,25.18 v34.35,25.15 | 34.35,26.05 34.52,25.18 v34.35,25.15
  Bottom 0.254: C6.1 34.16,11.7 | 34.16,11.7 NRF24L01_SMD.P$8 | v29.2,27.2 29.2,27.7 | 29.2,27.7 29.2,27.95 29.54,28.29 R18.1 | 34.16,11.7 34.1,11.76 34.1,12.95 35,13.85 35,15.75 35.2,15.95 | 35.2,15.95 v35.7,15.95 | v10.3,24.35 10.02,24.07 9.89,24.07 | 9.89,24.07 RFM95.13 | RFM95.13 8.08,23.95 | C10.1 4.15,24.9 4.1,24.85 | 4.1,24.85 v3.75,24.5 | v31.05,18.8 31.55,18.8 | 31.55,18.8 31.8,18.8 31.89,18.91 | 31.89,18.91 v32.2,19.3 | C11.1 C10.1 | C10.1 6.15,24.9 6.95,24.1 8.17,24.1 RFM95.13 | 29.2,27.7 29.01,27.29 v29.2,27.2 | 29.2,27.7 29.39,27.29 v29.2,27.2 | 35.2,15.95 35.61,15.76 v35.7,15.95 | 35.2,15.95 35.61,16.14 v35.7,15.95 | 9.89,24.07 10.33,24.14 v10.3,24.35 | 9.89,24.07 10.11,24.46 v10.3,24.35 | 4.1,24.85 3.68,24.7 v3.75,24.5 | 4.1,24.85 3.95,24.43 v3.75,24.5 | 31.89,18.91 32.29,19.11 v32.2,19.3 | 31.89,18.91 31.99,19.35 v32.2,19.3 | 31.55,18.8 31.14,18.99 v31.05,18.8 | 31.55,18.8 31.14,18.61 v31.05,18.8
  Bottom 0.61: REG1117.2 34.35,27.14
  Bottom 1.49: 34.35,27.14 v34.35,25.15 REG1117.4
  other vias: 31.7,21.5 32.95,23.2 37,21.5 31.7,20.5 32.05,22.45 35.75,23.2 36.65,22.45 36.5,19.3 37,20.5 30.75,23.2 30.75,22.25 30.75,21.3 37.4,23.2 34.35,23.2
  pour Bottom (isolate 0.305): 29.82,16.5 41.3,16.5 41.3,25.3 29.82,25.3
  pour Route2: 0.48,31.64 50.38,31.64 50.38,0.5 0.48,0.5
VDD
  Bottom 0.61: BAT60JFILM.C 35.95,29.71 35.95,28.85 36.66,28.14 REG1117.3

### Text on the board
bPlace: AriloRX | (c) J.ARIGITA